# Altium project PiDSP.PrjPcb (part 1 of 2)
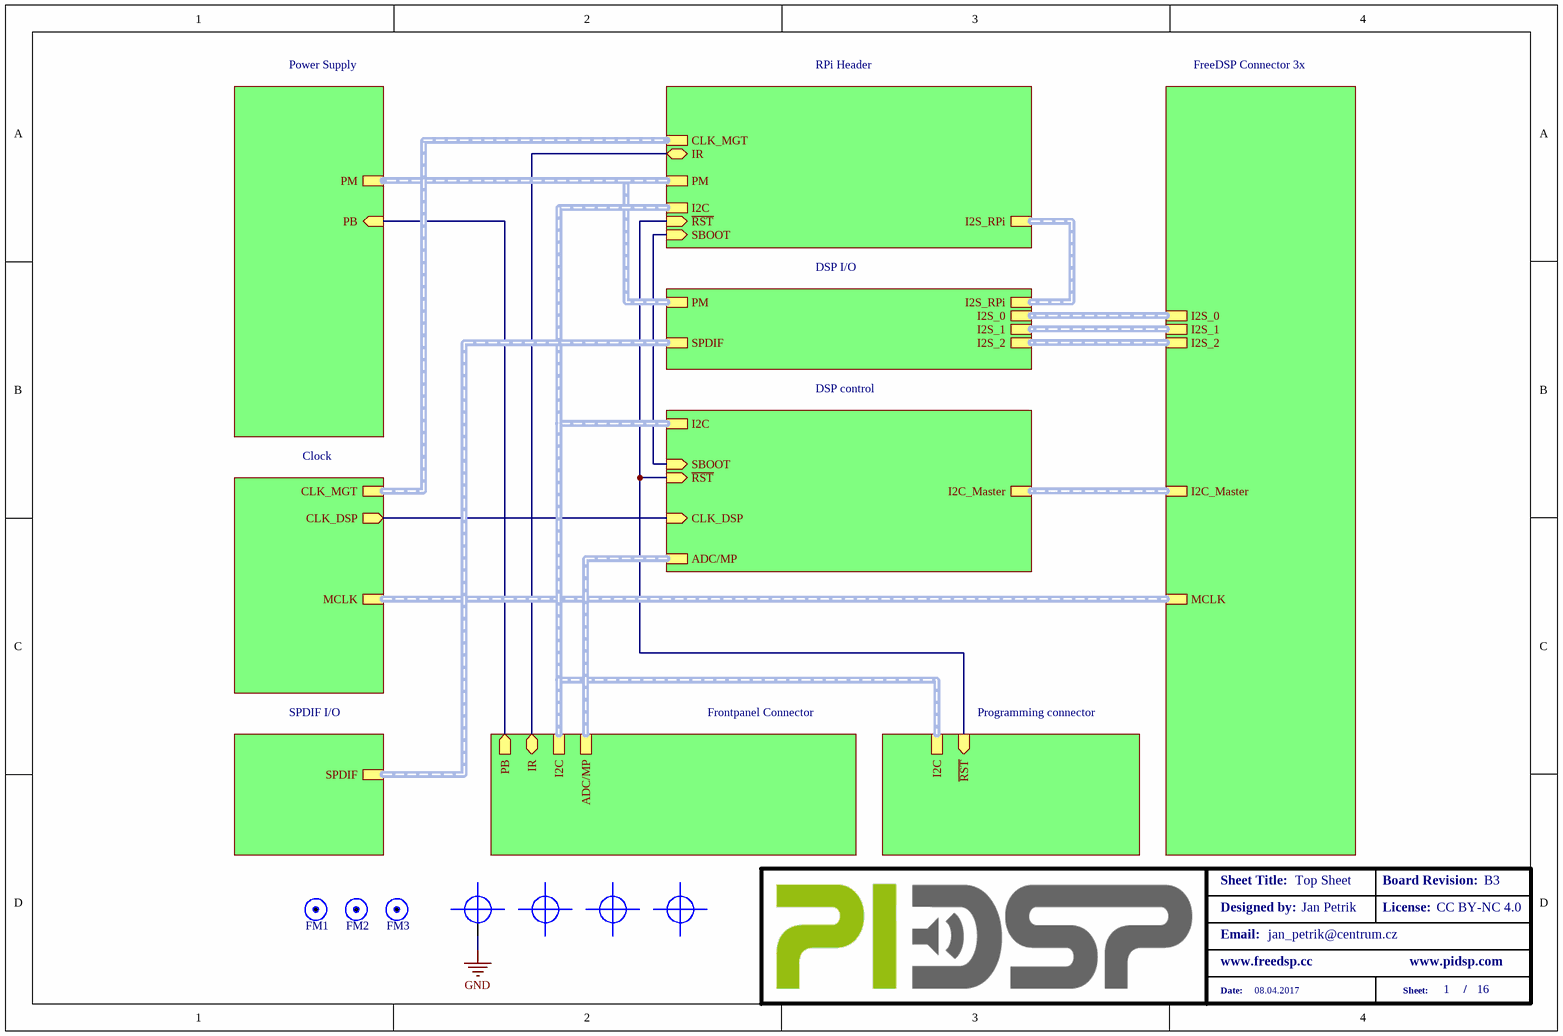
[diagram p0: DSP.SchDoc]
revision: B3
16 sheets, 290 parts. Net scope: hierarchical (ports join the sheet entries above them; power ports are global).
Board files: PiDSP.PcbDoc, footprint.PcbDoc
Sheets:
  DSP.SchDoc
    DSP control = DSPcontrol.SchDoc
    Clock = DSPclk.SchDoc
    DSP I/O = DSP_DIO.SchDoc
    RPi Header = RPi&MCU.SchDoc
    Power Supply = PowerSupply.SchDoc
      PLL Reg. = LP5907MFX-3.3NPB.SchDoc
      3.3V&1.2V = TPS54292.SchDoc
      Input = InputFilter.SchDoc
      Buck = Buck+PM.SchDoc
      Decoupling Capacitors = DSPPower.SchDoc
    FreeDSP Connector 3x = IOConn.SchDoc
    SPDIF I/O = SPDIF.SchDoc
    Frontpanel Connector = FrontPanelConnector.SchDoc
      ESD = ESD.SchDoc
    Programming connector = USBi.SchDoc

## Sheet DSP.SchDoc: Top Sheet
size A4; Date: 08.04.2017; Author: Jan Petrik; CompanyName: FreeDSP; DrawnBy: Jan Petrik; Organization: FreeDSP; DocumentNumber: 1; Revision: B3; SheetNumber: 1; SheetTotal: 16; email: jan_petrik@centrum.cz; license: CC BY-NC 4.0; PageSetup: Record=PageOptions|CenterHorizontal=True|CenterVertical=True|PrintScale=0.97|XCorrection=1.00|YCorrection=1.00|PrintKind=2|BorderSize=5000000|LeftOffset=0|BottomOffset=0|Orientation=2|PaperLength=1000|PaperWidth=1000|Scale=100|PaperSource=7|PrintQuality=-3|MediaType=1|DitherType=10|PrintScaleMode=1|PaperKind=A4|PaperIndex=9; drawing number: blablabla; Version1: N/A; Version2: N/A; Version3: N/A; Change1description: N/A; Change2description: N/A; Change3description: N/A; Change1DrawnBy: N/A; Change2DrawnBy: N/A; Change3DrawnBy: N/A; Change1CheckedBy: N/A; Change2CheckedBy: N/A; Change3CheckedBy: N/A; PreviusVersion_Chng1: N/A; PreviusVersion_Chng2: N/A; PreviusVersion_Chng3: N/A; Variant1description: Standard assembly; Variant2description: N/A; Variant3description: N/A; Variant4description: N/A

### Parts
FM1  Fiducial Mark Circle  [FM_CIRCLE_BTL]  (value not drawn)  (no BOM)
FM2  Fiducial Mark Circle  [FM_CIRCLE_BTL]  (value not drawn)  (no BOM)
FM3  Fiducial Mark Circle  [FM_CIRCLE_BTL]  (value not drawn)  (no BOM)
H1  M3_PLATED_TIGHT FIT  [HOLE_M3_Plated_TightFit]  (value not drawn)  (no BOM)
H2  M3_TIGHT_FIT  [HOLE_M3_TightFit]  (value not drawn)  (no BOM)
H3  M3_TIGHT_FIT  [HOLE_M3_TightFit]  (value not drawn)  (no BOM)
H4  M3_TIGHT_FIT  [HOLE_M3_TightFit]  (value not drawn)  (no BOM)

### Sub-sheets
Clock = DSPclk.SchDoc: MCLK (harness CLK), CLK_DSP (out), CLK_MGT (harness CLK_MGT)
DSP control = DSPcontrol.SchDoc: I2C_Master (harness I2C), SBOOT (in), ~{RST} (in), ADC/MP (harness ADC/MP), I2C (harness I2C), CLK_DSP (in)
DSP I/O = DSP_DIO.SchDoc: I2S_RPi (harness I2S), I2S_1 (harness I2S), I2S_2 (harness I2S), I2S_0 (harness I2S), PM (harness PM), SPDIF (harness SPDIF)
FreeDSP Connector 3x = IOConn.SchDoc: I2C_Master (harness I2C), I2S_0 (harness I2S), I2S_1 (harness I2S), I2S_2 (harness I2S), MCLK (harness CLK)
Frontpanel Connector = FrontPanelConnector.SchDoc: I2C (harness I2C), IR (bidir), ADC/MP (harness ADC/MP), PB (out)
Power Supply = PowerSupply.SchDoc: PB (in), PM (harness PM)
Programming connector = USBi.SchDoc: ~{RST} (in), I2C (harness I2C)
RPi Header = RPi&MCU.SchDoc: I2C (harness I2C), I2S_RPi (harness I2S), ~{RST} (in), SBOOT (in), IR (bidir), PM (harness PM), CLK_MGT (harness CLK_MGT)
SPDIF I/O = SPDIF.SchDoc: SPDIF (harness SPDIF)

### Nets
GND: H1.1
~{RST}: sheet DSP control/~{RST}, sheet RPi Header/~{RST}, sheet Programming connector/~{RST}
CLK_DSP: sheet DSP control/CLK_DSP, sheet Clock/CLK_DSP
IR: sheet RPi Header/IR, sheet Frontpanel Connector/IR
PB: sheet Power Supply/PB, sheet Frontpanel Connector/PB
SBOOT: sheet DSP control/SBOOT, sheet RPi Header/SBOOT

Not connected (* = marked no-connect by the designer): H2 #; H3 #; H4 #

### Buses and harness runs
harness sheet Clock/CLK_MGT = sheet RPi Header/CLK_MGT
harness sheet Clock/MCLK = sheet FreeDSP Connector 3x/MCLK
harness sheet DSP control/ADC/MP = sheet Frontpanel Connector/ADC/MP
harness sheet DSP control/I2C = sheet Frontpanel Connector/I2C = sheet Programming connector/I2C = sheet RPi Header/I2C
harness sheet DSP control/I2C_Master = sheet FreeDSP Connector 3x/I2C_Master
harness sheet DSP I/O/I2S_0 = sheet FreeDSP Connector 3x/I2S_0
harness sheet DSP I/O/I2S_1 = sheet FreeDSP Connector 3x/I2S_1
harness sheet DSP I/O/I2S_2 = sheet FreeDSP Connector 3x/I2S_2
harness sheet DSP I/O/I2S_RPi = sheet RPi Header/I2S_RPi
harness sheet DSP I/O/PM = sheet Power Supply/PM = sheet RPi Header/PM
harness sheet DSP I/O/SPDIF = sheet SPDIF I/O/SPDIF

### Notes on the sheet
- Designed by:
- Sheet Title:
- Board Revision:
- License:
- Email:
- www.freedsp.cc
- www.pidsp.com
- Date:
- Sheet:
- /

### Library data of the parts
FM1-FM3 = FIDUCIAL_MARK_CIRCLE_BTL: SMD: 1
H1 = M3_PLATED_TIGHT FIT: M3 mounting hole
H2-H4 = M3_TIGHT_FIT: M3 mounting hole

## Sheet DSPcontrol.SchDoc: DSP Control
size A4; Date: 08.04.2017; Author: Jan Petrik; CompanyName: FreeDSP; DrawnBy: Jan Petrik; Organization: FreeDSP; DocumentNumber: 10; Revision: B3; SheetNumber: 10; SheetTotal: 16; Version1: N/A; Version2: N/A; Version3: N/A; Change1description: N/A; Change2description: N/A; Change3description: N/A; Change1DrawnBy: N/A; Change2DrawnBy: N/A; Change3DrawnBy: N/A; Change1CheckedBy: N/A; Change2CheckedBy: N/A; Change3CheckedBy: N/A; PreviusVersion_Chng1: N/A; PreviusVersion_Chng2: N/A; PreviusVersion_Chng3: N/A; Variant1description: Standard assembly; Variant2description: N/A; Variant3description: N/A; Variant4description: N/A; email: jan_petrik@centrum.cz; license: CC BY-NC 4.0
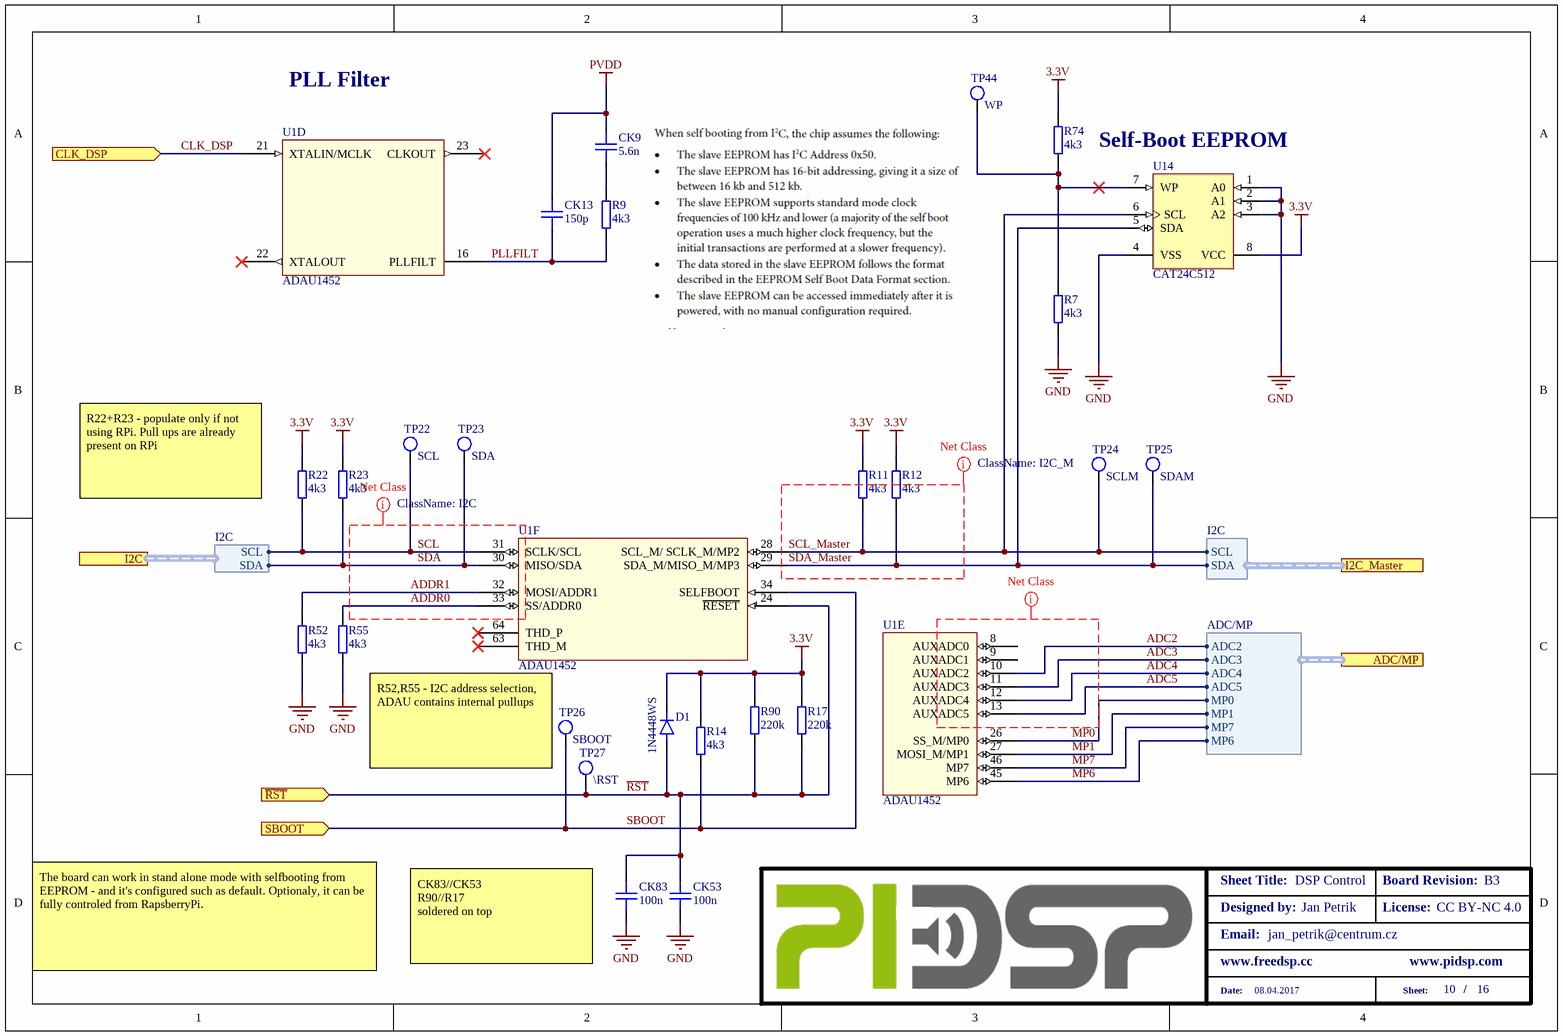
[diagram p1: DSPcontrol.SchDoc]

### Parts
CK9  5.6n  [CAPC1608X09N(SMC0603)]
CK13  150p  [CAPC1608X09N(SMC0603)]
CK53  100n  [CAPC1608X09N(SMC0603)]
CK83  100n  [CAPC1608X09N(SMC0603)]
D1  1N4448WS  [SOD-323]
R7  4k3  [RESC1608X06N(SMR0603)]
R9  4k3  [RESC1608X06N(SMR0603)]
R11  4k3  [RESC1608X06N(SMR0603)]
R12  4k3  [RESC1608X06N(SMR0603)]
R14  4k3  [RESC1608X06N(SMR0603)]
R17  220k  [RESC1608X06N(SMR0603)]
R22  4k3  [RESC1608X06N(SMR0603)]
R23  4k3  [RESC1608X06N(SMR0603)]
R52  4k3  [RESC1608X06N(SMR0603)]
R55  4k3  [RESC1608X06N(SMR0603)]
R74  4k3  [RESC1608X06N(SMR0603)]
R90  220k  [RESC1608X06N(SMR0603)]
TP22  SCL  [TP_0.8/0.4_ROUND]  (no BOM)
TP23  SDA  [TP_0.8/0.4_ROUND]  (no BOM)
TP24  SCLM  [TP_0.8/0.4_ROUND]  (no BOM)
TP25  SDAM  [TP_0.8/0.4_ROUND]  (no BOM)
TP26  SBOOT  [TP_0.8/0.4_ROUND]  (no BOM)
TP27  \RST  [TP_0.8/0.4_ROUND]  (no BOM)
TP44  WP  [TP_0.8/0.4_ROUND]  (no BOM)
U1  ADAU1452  [CP_72_6-handsoldering]  (parts D,E,F of 6)
U14  CAT24C512  [SOIC127P600X175-8N(SOIC_8)]

### Ports
ADC/MP (harness ADC/MP), CLK_DSP (in), I2C (harness I2C), I2C_Master (harness I2C), SBOOT (in), ~{RST} (in)

### Harnesses
I2C: SDA, SCL
ADC/MP: ADC2, ADC3, ADC4, ADC5, MP1, MP0, MP7, MP6
I2C: SCL, SDA

### Nets
3.3V: D1.1(C) R11.2 R12.2 R14.2 R17.2 R22.2 R23.2 R74.2 R90.2 U14.8(VCC)
GND: CK53.2 CK83.2 R7.1 R52.1 R55.1 U14.1(A0) U14.2(A1) U14.3(A2) U14.4(VSS)
PVDD: CK9.1 CK13.1
~{RST}: CK53.1 CK83.1 D1.2(A) R17.1 R90.1 TP27.1 U1.24(~{RESET}) ; port ~{RST}
ADC2: U1.10(AUXADC2) ; port ADC/MP.ADC2
ADC3: U1.11(AUXADC3) ; port ADC/MP.ADC3
ADC4: U1.12(AUXADC4) ; port ADC/MP.ADC4
ADC5: U1.13(AUXADC5) ; port ADC/MP.ADC5
ADDR0: R55.2 U1.33(SS/ADDR0)
ADDR1: R52.2 U1.32(MOSI/ADDR1)
CLK_DSP: U1.21(XTALIN/MCLK) ; port CLK_DSP
MP0: U1.26(SS_M/MP0) ; port ADC/MP.MP0
MP1: U1.27(MOSI_M/MP1) ; port ADC/MP.MP1
MP6: U1.45(MP6) ; port ADC/MP.MP6
MP7: U1.46(MP7) ; port ADC/MP.MP7
PLLFILT: CK13.2 R9.1 U1.16(PLLFILT)
SBOOT: R14.1 TP26.1 U1.34(SELFBOOT) ; port SBOOT
SCL: R22.1 TP22.1 U1.31(SCLK/SCL) ; port I2C.SCL
SCL_Master: R11.1 TP24.1 U1.28(SCL_M/_SCLK_M/MP2) U14.6(SCL) ; port I2C_Master.SCL
SDA: R23.1 TP23.1 U1.30(MISO/SDA) ; port I2C.SDA
SDA_Master: R12.1 TP25.1 U1.29(SDA_M/MISO_M/MP3) U14.5(SDA) ; port I2C_Master.SDA
NetCK9_2: CK9.2 R9.2
NetR7_2: R7.2 R74.1 TP44.1 U14.7(WP)

Not connected (* = marked no-connect by the designer): U1 8(AUXADC0) 9(AUXADC1) 22(XTALOUT)* 23(CLKOUT)* 63(THD_M)* 64(THD_P)*

### Layout directives
net class I2C: ADDR0, ADDR1, SCL, SDA
net class ADC: (no net found under the mark)
net class I2C_M: SCL_Master, SDA_Master

### Notes on the sheet
- PLL Filter
- Self-Boot EEPROM
- (near R22) R22+R23 - populate only if not using RPi. Pull ups are already present on RPi
- (near TP26) R52,R55 - I2C address selection,
  ADAU contains internal pullups
- The board can work in stand alone mode with selfbooting from EEPROM - and it's configured such as default. Optionaly, it can be fully controled from RapsberryPi.
- (near CK83) CK83//CK53
  R90//R17
  soldered on top
- Designed by:
- Sheet Title:
- Board Revision:
- License:
- Email:
- www.freedsp.cc
- www.pidsp.com
- Date:
- Sheet:
- /

### Library data of the parts
CK9 = 5.6n-50V-0603-X7R: MLCC; Mfg. Part Number: 81-GRM1885C1H562JA1D; Signal Integrity: Cap; Tolerance: 10%; Voltage: 50V; Mfgr.: Murata; Value: 5.6n; Package: SMC0603; Simulation: Cap; Author: JP/27.03.2014; Supplier 1: Mouser
CK13 = 150p-50V-0603-NP0: MLCC; Mfg. Part Number: 80-C0603C151J5G; Signal Integrity: Cap; Tolerance: 10%; Voltage: 50V; Value: 150p; Package: SMC0603; Simulation: Cap; Author: JP/27.03.2014; Supplier 1: Mouser
CK53 CK83 = 100n-50V-0603-X7R: MLCC; Signal Integrity: Cap; Voltage: 50V; Tolerance: 10%; Value: 100n; Package: SMC2523; Simulation: Cap; Author: JP/27.03.2014; Supplier 1: Mouser; Supplier Part Number 1: 81-GRM39X104K50D
D1 = 1N4448WS: Small signal diode; Current: 0.150A; Voltage: 75V; SMD: 1; Type: Diode; Package: SOD-323; Supplier 1: Mouser; Supplier Part Number 1: 512-1N4448WS
R7 R9 R11 R12 R14 R22 R23 R52 R55 R74 = 4K3-100mW-0603-ThickFilm: Chip Resistor; Tolerance & Rating: 1%/0.1W; Signal Integrity: Res; Packare: SMR0603; Value: 4k3; Simulation: Res; Author: JP/10.06.2014; SMD: 1; Supplier 1: Mouser; Supplier Part Number 1: 603-RC0603FR-074K3L; Type: Resistor
R17 R90 = 220k-100mW-0603-ThickFilm: Chip Resistor; Tolerance & Rating: 1%/0.1W; Signal Integrity: Res; Packare: SMR0603; Value: 220k; Simulation: Res; Author: JP/10.06.2014; SMD: 1; Supplier 1: Mouser; Supplier Part Number 1: 603-RC0603FR-07220KL; Type: Resistor
TP22-TP27 TP44 = TEST_POINT_VIA: Testpoint - VIA; Value: 0.65/1.55; SMD: -; ClassName: TP
U14 = CAT24C512: 512 Kb I2C CMOS Serial  EEPROM; Supplier 1: Mouser; Supplier Part Number 1: 863-CAT24C512WI-GT3
U1 = ADAU1452: SMD: 1; Supplier 1: Mouser; Supplier Part Number 1: 584-ADAU1452WBCPZ

## Sheet DSPclk.SchDoc: Clock Management
size A4; Date: 08.04.2017; Author: Jan Petrik; CompanyName: FreeDSP; DrawnBy: Jan Petrik; Organization: FreeDSP; DocumentNumber: 8; Revision: B2; SheetNumber: 8; SheetTotal: 16; email: jan_petrik@centrum.cz; license: CC BY-NC 4.0
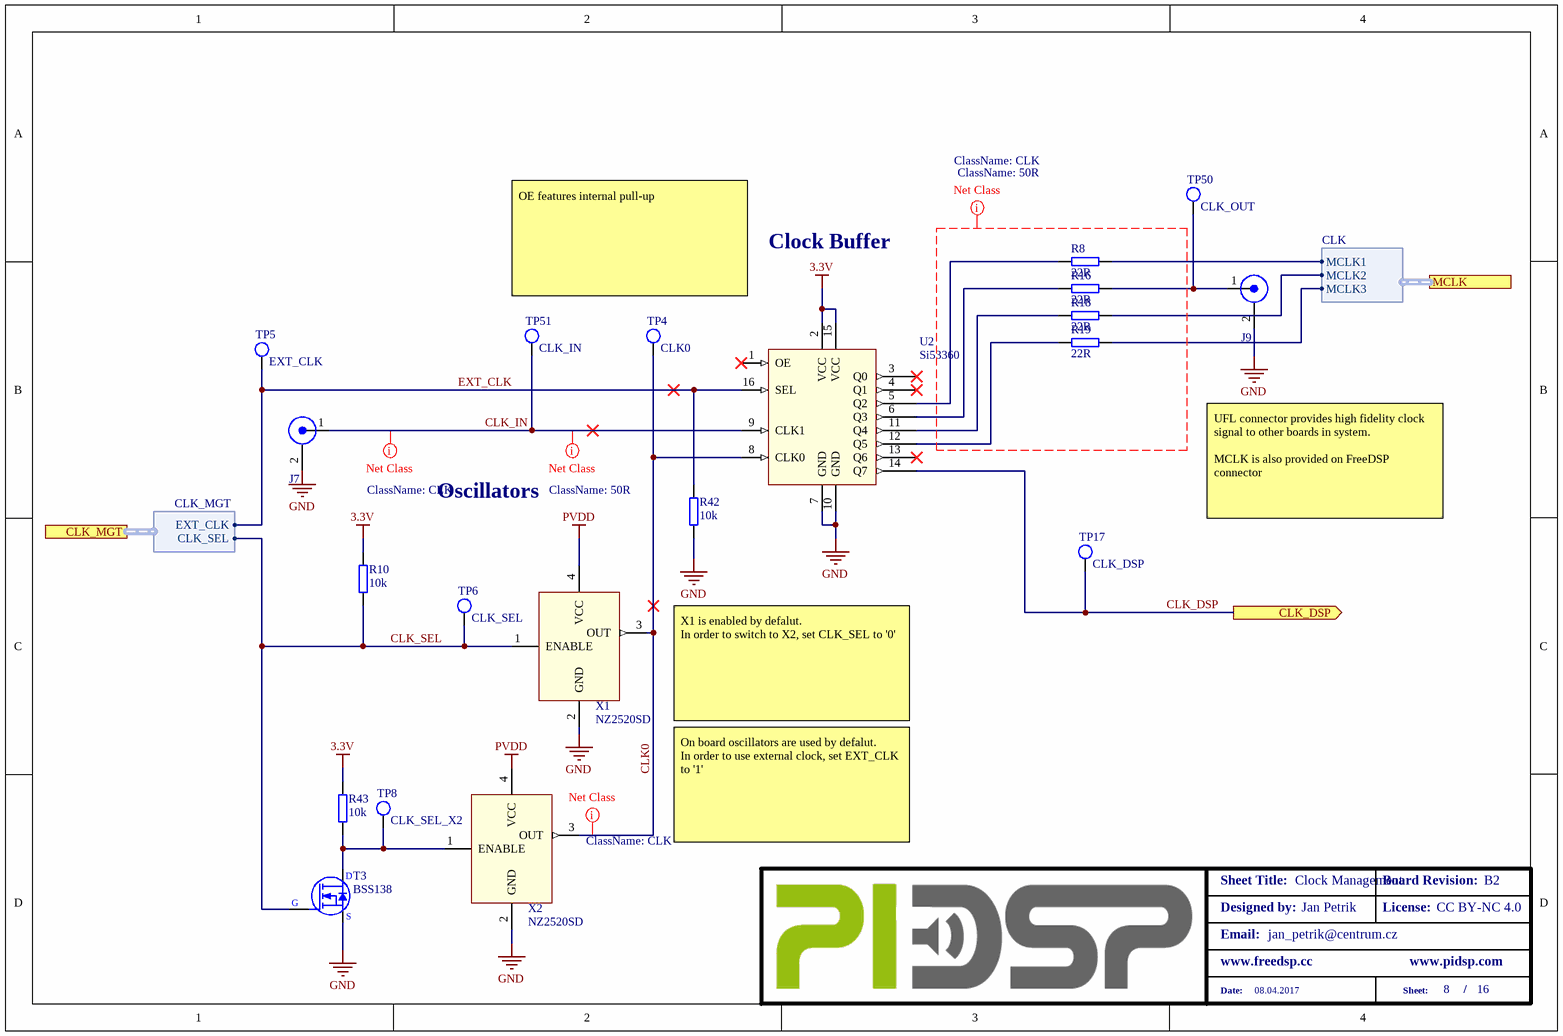
[diagram p2: DSPclk.SchDoc]

### Parts
J7  CLK_IN  [U.FL-R-SMT]  (value not drawn)
J9  CLK_OUT  [U.FL-R-SMT]  (value not drawn)
R8  22R  [RESC1608X06N(SMR0603)]
R10  10k  [RESC1608X06N(SMR0603)]
R16  22R  [RESC1608X06N(SMR0603)]
R18  22R  [RESC1608X06N(SMR0603)]
R19  22R  [RESC1608X06N(SMR0603)]
R42  10k  [RESC1608X06N(SMR0603)]
R43  10k  [RESC1608X06N(SMR0603)]
T3  BSS138  [SOT95P230X110-3N(SOT23)]
TP4  CLK0  [TP_0.8/0.4_ROUND]  (no BOM)
TP5  EXT_CLK  [TP_0.8/0.4_ROUND]  (no BOM)
TP6  CLK_SEL  [TP_0.8/0.4_ROUND]  (no BOM)
TP8  CLK_SEL_X2  [TP_0.8/0.4_ROUND]  (no BOM)
TP17  CLK_DSP  [TP_0.8/0.4_ROUND]  (no BOM)
TP50  CLK_OUT  [TP_0.8/0.4_ROUND]  (no BOM)
TP51  CLK_IN  [TP_0.8/0.4_ROUND]  (no BOM)
U2  Si53360  [TSOP65P640X120-16N (TSSOP16-4.4MM)]
X1  NZ2520SD  [2.5x2mm osclillator]
X2  NZ2520SD  [2.5x2mm osclillator]

### Ports
CLK_DSP (out), CLK_MGT (harness CLK_MGT), MCLK (harness CLK)

### Harnesses
CLK: MCLK1, MCLK2, MCLK3
CLK_MGT: EXT_CLK, CLK_SEL

### Nets
3.3V: R10.2 R43.2 U2.2(VCC) U2.15(VCC)
GND: J7.2(GND) J9.2(GND) R42.1 T3.2(S) U2.7(GND) U2.10(GND) X1.2(GND) X2.2(GND)
PVDD: X1.4(VCC) X2.4(VCC)
CLK0: TP4.1 U2.8(CLK0) X1.3(OUT) X2.3(OUT)
CLK_DSP: TP17.1 U2.14(Q7) ; port CLK_DSP
CLK_IN: J7.1(Signal) TP51.1 U2.9(CLK1)
CLK_SEL: R10.1 T3.1(G) TP6.1 X1.1(ENABLE) ; port CLK_MGT.CLK_SEL
EXT_CLK: R42.2 TP5.1 U2.16(SEL) ; port CLK_MGT.EXT_CLK
MCLK1: R8.2 ; port MCLK.MCLK1
MCLK2: R18.2 ; port MCLK.MCLK2
MCLK3: R19.2 ; port MCLK.MCLK3
NetJ9_1: J9.1(Signal) R16.2 TP50.1
NetR8_1: R8.1 U2.5(Q2)
NetR16_1: R16.1 U2.6(Q3)
NetR18_1: R18.1 U2.11(Q4)
NetR19_1: R19.1 U2.12(Q5)
NetR43_1: R43.1 T3.3(D) TP8.1 X2.1(ENABLE)

Not connected (* = marked no-connect by the designer): U2 1(OE)* 3(Q0)* 4(Q1)* 13(Q6)*

### Layout directives
net class CLK: CLK0, CLK_IN
net class CLK; net class 50R: (no net found under the mark)
net class 50R: CLK_IN

### Notes on the sheet
- Clock Buffer
- OE features internal pull-up
- Oscillators
- UFL connector provides high fidelity clock signal to other boards in system.
  MCLK is also provided on FreeDSP connector
- X1 is enabled by defalut.
  In order to switch to X2, set CLK_SEL to '0'
- On board oscillators are used by defalut.
  In order to use external clock, set EXT_CLK to '1'
- Designed by:
- Sheet Title:
- Board Revision:
- License:
- Email:
- www.freedsp.cc
- www.pidsp.com
- Date:
- Sheet:
- /

### Library data of the parts
J7 J9 = UFL: Subminiature connector; Mfg. PN: 1909763-1; SMD: 0; Supplier 1: Mouser; Supplier Part Number 1: 571-1909763-1
R8 R16 R18 R19 = 22R-100mW-0603-ThickFilm: Chip Resistor; Tolerance & Rating: 1%/0.1W; Signal Integrity: Res; Packare: SMR0603; Value: 22R; Simulation: Res; Author: JP/10.06.2014; SMD: 1; Supplier 1: Mouser; Supplier Part Number 1: 603-RC0603FR-0722RL; Type: Resistor
R10 R42 R43 = 10k-100mW-0603-ThickFilm: Chip Resistor; Tolerance & Rating: 1%/0.1W; Signal Integrity: Res; Packare: SMR0603; Value: 10k; Simulation: Res; Author: JP/10.06.2014; SMD: 1; Supplier 1: Mouser; Supplier Part Number 1: 603-RC0603FR-0710KL; Type: Resistor
T3 = ET+BSS138XX0: N-MOSFET, Logic Level, 50V/0,22A/3.5Ohm; Tolerance & Rating: 50 V/0,2 A/0,36 W; Author: JM 2.7.2014; SMD: 1; Value: BSS138; PN: BSS138; Supplier 1: Mouser; Supplier Part Number 1: 512-BSS138
TP4-TP6 TP8 TP17 TP50 TP51 = TEST_POINT_VIA: Testpoint - VIA; Value: 0.65/1.55; SMD: -; ClassName: TP
U2 = Si53360: 1:8 LOW JITTER CMOS CLOCK BUFFER  WITH 2:1 INPUT MUX; SMD: 1; Supplier 1: Mouser; Value: Si53360; Supplier Part Number 1: 634-SI53360-B-GT
X1 X2 = NZ2520SD: Low Phase Noise Oscillator

## Sheet DSP_DIO.SchDoc: DSP I/O
size A4; Date: 08.04.2017; Author: Jan Petrik; CompanyName: FreeDSP; DrawnBy: Jan Petrik; Organization: FreeDSP; DocumentNumber: 11; Revision: B2; SheetNumber: 11; SheetTotal: 16; email: jan_petrik@centrum.cz; license: CC BY-NC 4.0; PageSetup: Record=PageOptions|CenterHorizontal=True|CenterVertical=True|PrintScale=0.97|XCorrection=1.00|YCorrection=1.00|PrintKind=2|BorderSize=5000000|LeftOffset=0|BottomOffset=0|Orientation=2|PaperLength=1000|PaperWidth=1000|Scale=100|PaperSource=7|PrintQuality=-3|MediaType=1|DitherType=10|PrintScaleMode=1|PaperKind=A4|PaperIndex=9; drawing number: blablabla; Version1: N/A; Version2: N/A; Version3: N/A; Change1description: N/A; Change2description: N/A; Change3description: N/A; Change1DrawnBy: N/A; Change2DrawnBy: N/A; Change3DrawnBy: N/A; Change1CheckedBy: N/A; Change2CheckedBy: N/A; Change3CheckedBy: N/A; PreviusVersion_Chng1: N/A; PreviusVersion_Chng2: N/A; PreviusVersion_Chng3: N/A; Variant1description: Standard assembly; Variant2description: N/A; Variant3description: N/A; Variant4description: N/A
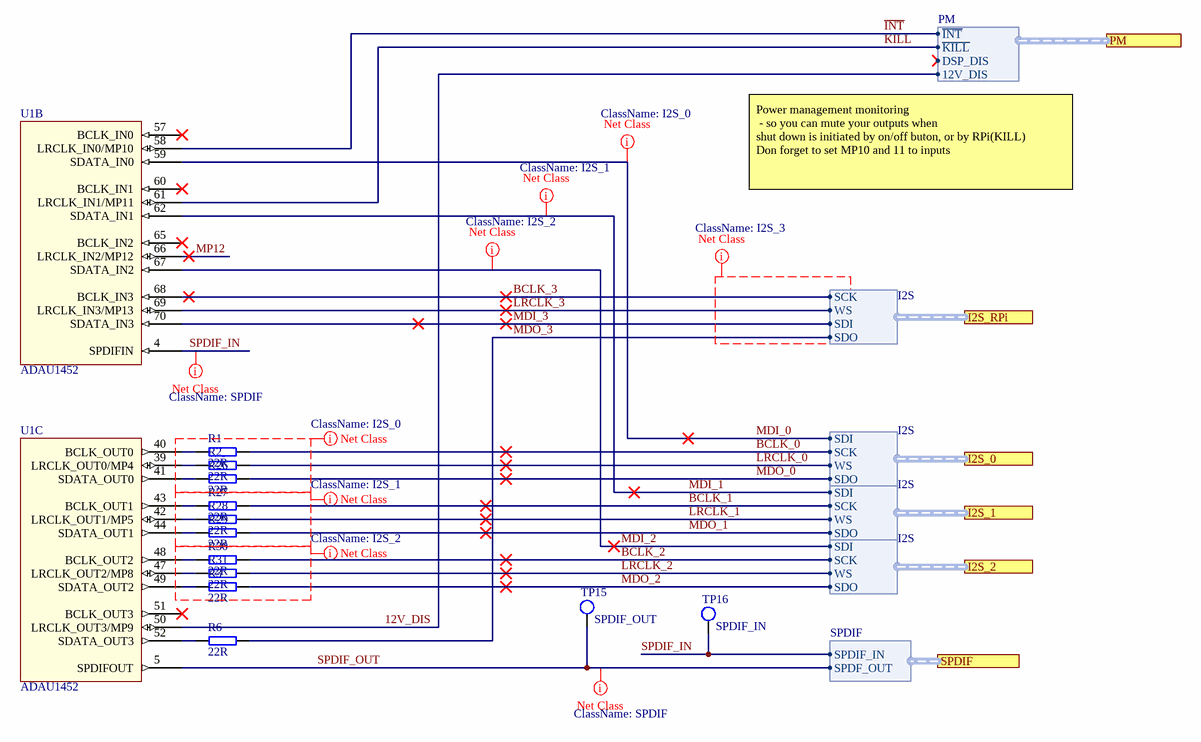
[diagram p3: DSP_DIO.SchDoc]

### Parts
R1  22R  [RESC1608X06N(SMR0603)]
R2  22R  [RESC1608X06N(SMR0603)]
R3  22R  [RESC1608X06N(SMR0603)]
R6  22R  [RESC1608X06N(SMR0603)]
R26  22R  [RESC1608X06N(SMR0603)]
R27  22R  [RESC1608X06N(SMR0603)]
R28  22R  [RESC1608X06N(SMR0603)]
R29  22R  [RESC1608X06N(SMR0603)]
R30  22R  [RESC1608X06N(SMR0603)]
R31  22R  [RESC1608X06N(SMR0603)]
TP15  SPDIF_OUT  [TP_0.8/0.4_ROUND]  (no BOM)
TP16  SPDIF_IN  [TP_0.8/0.4_ROUND]  (no BOM)
U1  ADAU1452  [CP_72_6-handsoldering]  (parts B,C of 6)

### Ports
I2S_0 (harness I2S), I2S_1 (harness I2S), I2S_2 (harness I2S), I2S_RPi (harness I2S), PM (harness PM), SPDIF (harness SPDIF)

### Harnesses
I2S: SDI, WS, SCK, SDO
PM: ~{INT}, ~{KILL}, DSP_DIS, 12V_DIS
SPDIF: SPDIF_IN, SPDF_OUT

### Nets
12V_DIS: U1.50(LRCLK_OUT3/MP9) ; port PM.12V_DIS
BCLK_0: R1.1 ; port I2S_0.SCK  [project net BCKO_0]
BCLK_1: R27.1 ; port I2S_1.SCK  [project net BCKO_1]
BCLK_2: R30.1 ; port I2S_2.SCK  [project net BCKO_2]
BCLK_3: U1.68(BCLK_IN3) ; port I2S_RPi.SCK  [project net BCKI_3]
~{INT}: U1.58(LRCLK_IN0/MP10) ; port PM.~{INT}
~{KILL}: U1.61(LRCLK_IN1/MP11) ; port PM.~{KILL}
LRCLK_0: R2.1 ; port I2S_0.WS  [project net LRCKO_0]
LRCLK_1: R28.1 ; port I2S_1.WS  [project net LRCKO_1]
LRCLK_2: R31.1 ; port I2S_2.WS  [project net LRCKO_2]
LRCLK_3: U1.69(LRCLK_IN3/MP13) ; port I2S_RPi.WS  [project net LRCKI_3]
MDI_0: U1.59(SDATA_IN0) ; port I2S_0.SDI
MDI_1: U1.62(SDATA_IN1) ; port I2S_1.SDI
MDI_2: U1.67(SDATA_IN2) ; port I2S_2.SDI
MDI_3: U1.70(SDATA_IN3) ; port I2S_RPi.SDI
MDO_0: R26.1 ; port I2S_0.SDO
MDO_1: R29.1 ; port I2S_1.SDO
MDO_2: R3.1 ; port I2S_2.SDO
MDO_3: R6.1 ; port I2S_RPi.SDO
MP12: U1.66(LRCLK_IN2/MP12)
SPDIF_IN: TP16.1 U1.4(SPDIFIN) ; port SPDIF.SPDIF_IN
SPDIF_OUT: TP15.1 U1.5(SPDIFOUT) ; port SPDIF.SPDF_OUT
NetR1_2: R1.2 U1.40(BCLK_OUT0)
NetR2_2: R2.2 U1.39(LRCLK_OUT0/MP4)
NetR3_2: R3.2 U1.49(SDATA_OUT2)
NetR6_2: R6.2 U1.52(SDATA_OUT3)
NetR26_2: R26.2 U1.41(SDATA_OUT0)
NetR27_2: R27.2 U1.43(BCLK_OUT1)
NetR28_2: R28.2 U1.42(LRCLK_OUT1/MP5)
NetR29_2: R29.2 U1.44(SDATA_OUT1)
NetR30_2: R30.2 U1.48(BCLK_OUT2)
NetR31_2: R31.2 U1.47(LRCLK_OUT2/MP8)

Not connected (* = marked no-connect by the designer): U1 51(BCLK_OUT3)* 57(BCLK_IN0)* 60(BCLK_IN1)* 65(BCLK_IN2)*

### Layout directives
net class I2S_0: (no net found under the mark), MDI_0
net class I2S_1: (no net found under the mark), MDI_1
net class I2S_2: (no net found under the mark), MDI_2
net class I2S_3: (no net found under the mark)
net class SPDIF: SPDIF_IN, SPDIF_OUT

### Notes on the sheet
- Power management monitoring
  - so you can mute your outputs when
  shut down is initiated by on/off buton, or by RPi(KILL)
  Don forget to set MP10 and 11 to inputs
- Designed by:
- Sheet Title:
- Board Revision:
- License:
- Email:
- www.freedsp.cc
- www.pidsp.com
- Date:
- Sheet:
- /

### Library data of the parts
R1-R3 R6 R26-R31 = 22R-100mW-0603-ThickFilm: as R8 on sheet DSPclk; Value: 22R; Simulation: Res; Author: JP/10.06.2014; SMD: 1; Supplier 1: Mouser; Supplier Part Number 1: 603-RC0603FR-0722RL; Type: Resistor
TP15 TP16 = TEST_POINT_VIA: Testpoint - VIA; Value: 0.65/1.55; SMD: -; ClassName: TP
U1 = ADAU1452: SMD: 1; Supplier 1: Mouser; Supplier Part Number 1: 584-ADAU1452WBCPZ

## Sheet RPi&MCU.SchDoc: RPi
size A4; Date: 08.04.2017; Author: Jan Petrik; CompanyName: FreeDSP; DrawnBy: Jan Petrik; Organization: FreeDSP; DocumentNumber: 9; Revision: B2; SheetNumber: 9; SheetTotal: 16; email: jan_petrik@centrum.cz; license: CC BY-NC 4.0
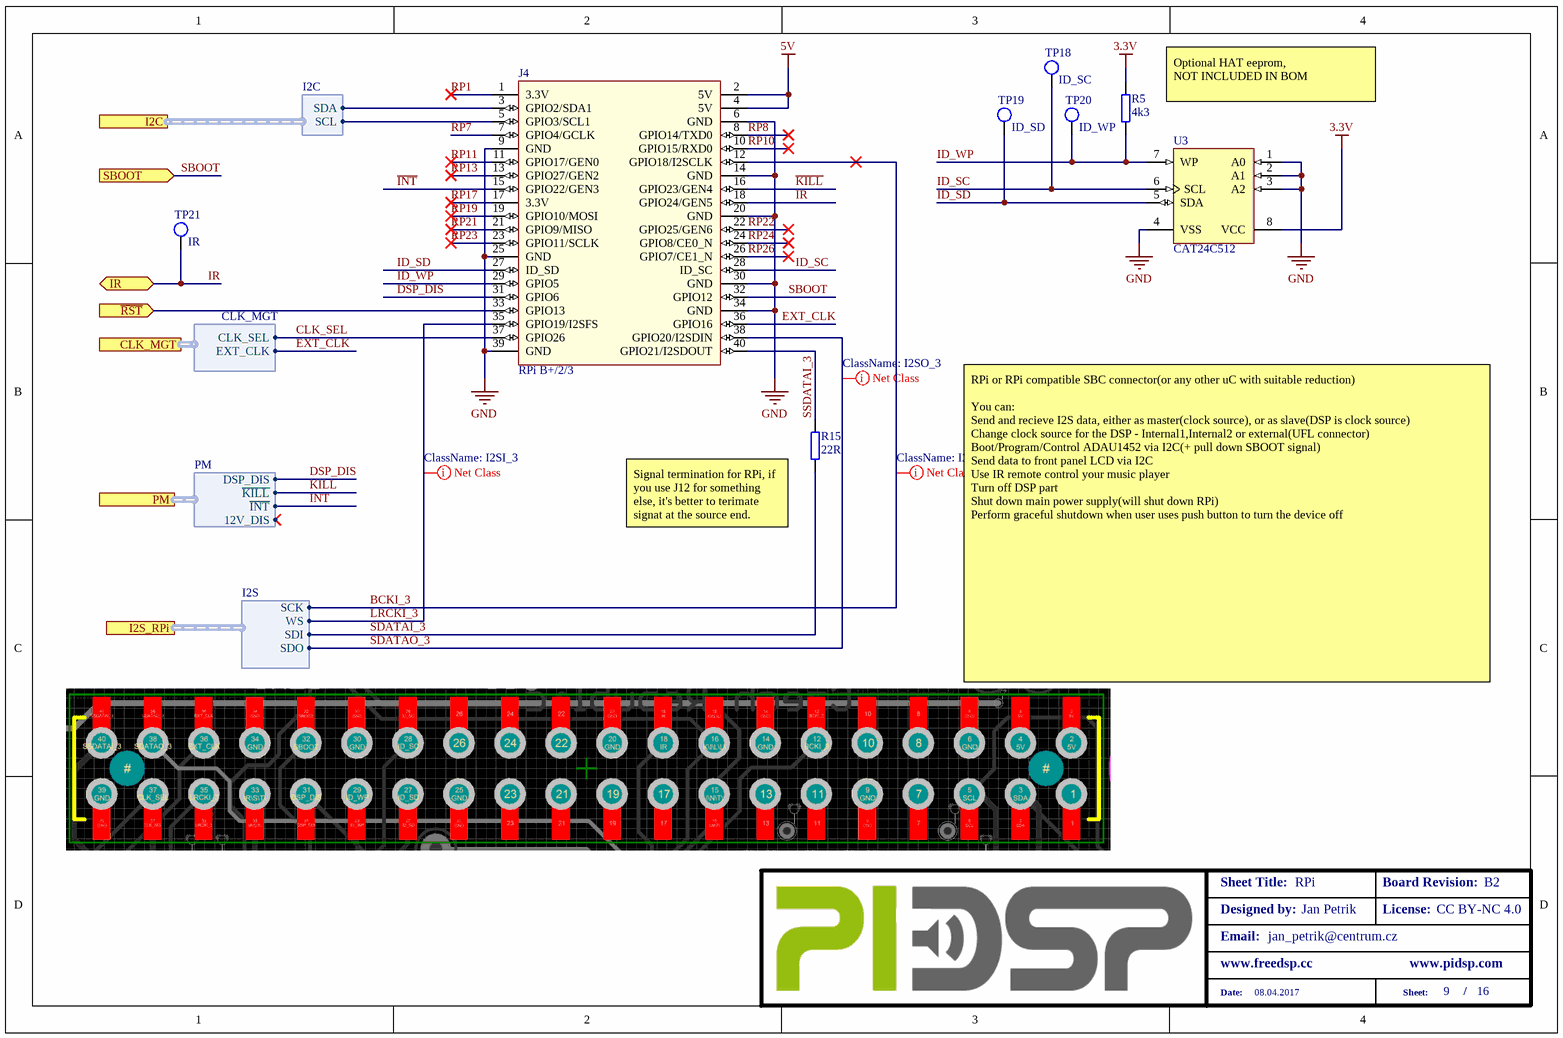
[diagram p4: RPi&MCU.SchDoc]

### Parts
J4  RPi B+/2/3  [RPi 2]
R5  4k3  [RESC1608X06N(SMR0603)]
R15  22R  [RESC1608X06N(SMR0603)]
TP18  ID_SC  [TP_0.8/0.4_ROUND]  (no BOM)
TP19  ID_SD  [TP_0.8/0.4_ROUND]  (no BOM)
TP20  ID_WP  [TP_0.8/0.4_ROUND]  (no BOM)
TP21  IR  [TP_0.8/0.4_ROUND]  (no BOM)
U3  CAT24C512  [SOIC127P600X175-8N(SOIC_8)]

### Ports
CLK_MGT (harness CLK_MGT), I2C (harness I2C), I2S_RPi (harness I2S), IR (bidir), PM (harness PM), SBOOT (in), ~{RST} (in)

### Harnesses
I2C: SDA, SCL
I2S: SDI, WS, SCK, SDO
PM: ~{INT}, ~{KILL}, DSP_DIS, 12V_DIS
CLK_MGT: EXT_CLK, CLK_SEL

### Nets
3.3V: R5.2 U3.8(VCC)
5V: J4.2(5V) J4.4(5V)
GND: J4.6(GND) J4.9(GND) J4.14(GND) J4.20(GND) J4.25(GND) J4.30(GND) J4.34(GND) J4.39(GND) U3.1(A0) U3.2(A1) U3.3(A2) U3.4(VSS)
~{RST}: J4.33(GPIO13) ; port ~{RST}
BCKI_3: J4.12(GPIO18/I2SCLK) ; port I2S_RPi.SCK
CLK_SEL: J4.37(GPIO26) ; port CLK_MGT.CLK_SEL
DSP_DIS: J4.31(GPIO6) ; port PM.DSP_DIS
EXT_CLK: J4.36(GPIO16) ; port CLK_MGT.EXT_CLK
~{INT}: J4.15(GPIO22/GEN3) ; port PM.~{INT}
ID_SC: J4.28(ID_SC) TP18.1 U3.6(SCL)
ID_SD: J4.27(ID_SD) TP19.1 U3.5(SDA)
ID_WP: J4.29(GPIO5) R5.1 TP20.1 U3.7(WP)
IR: J4.18(GPIO24/GEN5) TP21.1 ; port IR
~{KILL}: J4.16(GPIO23/GEN4) ; port PM.~{KILL}
LRCKI_3: J4.35(GPIO19/I2SFS) ; port I2S_RPi.WS
RP1: J4.1(3.3V)
RP7: J4.7(GPIO4/GCLK)
RP8: J4.8(GPIO14/TXD0)
RP10: J4.10(GPIO15/RXD0)
RP11: J4.11(GPIO17/GEN0)
RP13: J4.13(GPIO27/GEN2)
RP17: J4.17(3.3V)
RP19: J4.19(GPIO10/MOSI)
RP21: J4.21(GPIO9/MISO)
RP22: J4.22(GPIO25/GEN6)
RP23: J4.23(GPIO11/SCLK)
RP24: J4.24(GPIO8/CE0_N)
RP26: J4.26(GPIO7/CE1_N)
SBOOT: J4.32(GPIO12) ; port SBOOT
SCL: J4.5(GPIO3/SCL1) ; port I2C.SCL
SDA: J4.3(GPIO2/SDA1) ; port I2C.SDA
SDATAI_3: R15.1 ; port I2S_RPi.SDI  [project net MDI_3]
SDATAO_3: J4.38(GPIO20/I2SDIN) ; port I2S_RPi.SDO  [project net MDO_3]
SSDATAI_3: J4.40(GPIO21/I2SDOUT) R15.2

### Layout directives
net class I2SO_3: MDO_3
net class I2SI_3: BCKI_3, LRCKI_3

### Notes on the sheet
- Optional HAT eeprom,
  NOT INCLUDED IN BOM
- (near R15) Signal termination for RPi, if you use J12 for something else, it's better to terimate signat at the source end.
- RPi or RPi compatible SBC connector(or any other uC with suitable reduction)
  You can:
  Send and recieve I2S data, either as master(clock source), or as slave(DSP is clock source)
  Change clock source for the DSP - Internal1,Internal2 or external(UFL connector)
  Boot/Program/Control ADAU1452 via I2C(+ pull down SBOOT signal)
  Send data to front panel LCD via I2C
  Use IR remote control your music player
  Turn off DSP part
  Shut down main power supply(will shut down RPi)
  Perform graceful shutdown when user uses push button to turn the device off
- Designed by:
- Sheet Title:
- Board Revision:
- License:
- Email:
- www.freedsp.cc
- www.pidsp.com
- Date:
- Sheet:
- /

### Library data of the parts
J4 = Rapsberry Pi 2 B: Rapsberry Pi Header; SMD: 0; Supplier 1: Mouser; Supplier Part Number 1: 517-929975-01-20
R5 = 4K3-100mW-0603-ThickFilm: as R7 on sheet DSPcontrol; Value: 4k3; Simulation: Res; Author: JP/10.06.2014; SMD: 1; Supplier 1: Mouser; Supplier Part Number 1: 603-RC0603FR-074K3L; Type: Resistor
R15 = 22R-100mW-0603-ThickFilm: as R8 on sheet DSPclk; Value: 22R; Simulation: Res; Author: JP/10.06.2014; SMD: 1; Supplier 1: Mouser; Supplier Part Number 1: 603-RC0603FR-0722RL; Type: Resistor
TP18-TP21 = TEST_POINT_VIA: Testpoint - VIA; Value: 0.65/1.55; SMD: -; ClassName: TP
U3 = CAT24C512: 512 Kb I2C CMOS Serial  EEPROM; Supplier 1: Mouser; Supplier Part Number 1: 863-CAT24C512WI-GT3

## Sheet PowerSupply.SchDoc: Power Supply
size A4; Date: 08.04.2017; Author: Jan Petrik; CompanyName: FreeDSP; DrawnBy: Jan Petrik; Organization: FreeDSP; DocumentNumber: 2; Revision: B3; SheetNumber: 2; SheetTotal: 16; email: jan_petrik@centrum.cz; license: CC BY-NC 4.0; PageSetup: Record=PageOptions|CenterHorizontal=True|CenterVertical=True|PrintScale=0.97|XCorrection=1.00|YCorrection=1.00|PrintKind=2|BorderSize=5000000|LeftOffset=0|BottomOffset=0|Orientation=2|PaperLength=1000|PaperWidth=1000|Scale=100|PaperSource=7|PrintQuality=-3|MediaType=1|DitherType=10|PrintScaleMode=1|PaperKind=A4|PaperIndex=9; drawing number: blablabla; Version1: N/A; Version2: N/A; Version3: N/A; Change1description: N/A; Change2description: N/A; Change3description: N/A; Change1DrawnBy: N/A; Change2DrawnBy: N/A; Change3DrawnBy: N/A; Change1CheckedBy: N/A; Change2CheckedBy: N/A; Change3CheckedBy: N/A; PreviusVersion_Chng1: N/A; PreviusVersion_Chng2: N/A; PreviusVersion_Chng3: N/A; Variant1description: Standard assembly; Variant2description: N/A; Variant3description: N/A; Variant4description: N/A
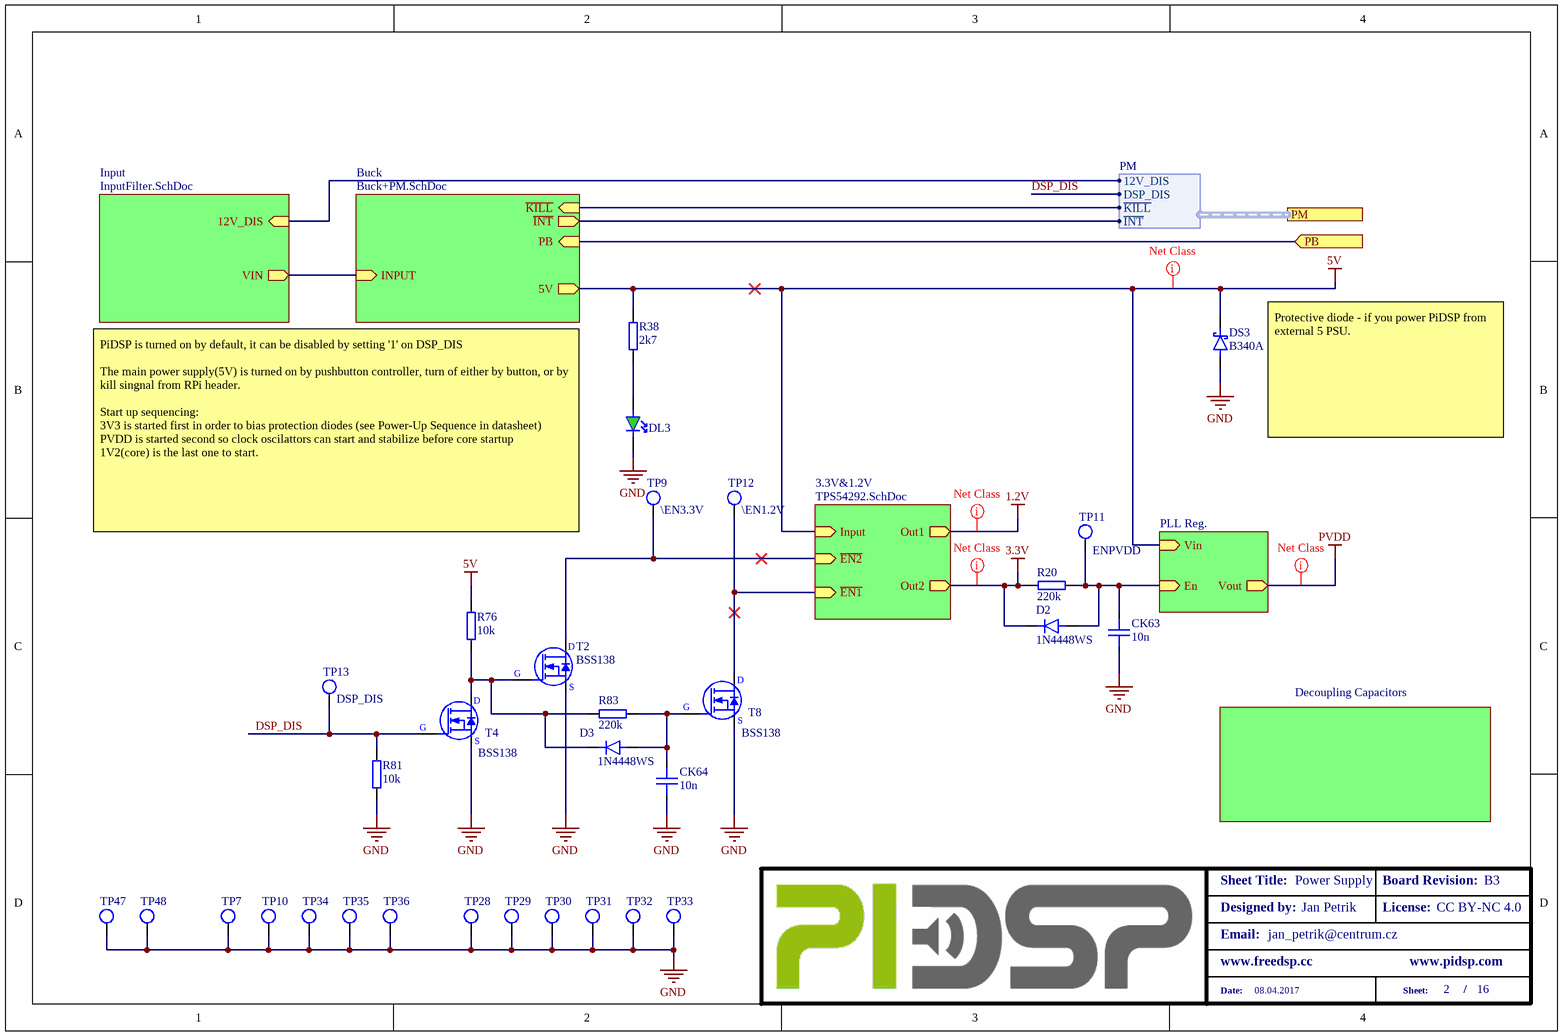
[diagram p5: PowerSupply.SchDoc]

### Parts
CK63  10n  [CAPC1608X09N(SMC0603)]
CK64  10n  [CAPC1608X09N(SMC0603)]
D2  1N4448WS  [SOD-323]
D3  1N4448WS  [SOD-323]
DL3  GREEN  [0603diode]  (value not drawn)
DS3  B340A  [DIOM5127X23N(SMA)]
R20  220k  [RESC1608X06N(SMR0603)]
R38  2k7  [RESC1608X06N(SMR0603)]
R76  10k  [RESC1608X06N(SMR0603)]
R81  10k  [RESC1608X06N(SMR0603)]
R83  220k  [RESC1608X06N(SMR0603)]
T2  BSS138  [SOT95P230X110-3N(SOT23)]
T4  BSS138  [SOT95P230X110-3N(SOT23)]
T8  BSS138  [SOT95P230X110-3N(SOT23)]
TP7  GND  [TP_0.8/0.4_ROUND]  (value not drawn)  (no BOM)
TP9  \EN3.3V  [TP_0.8/0.4_ROUND]  (no BOM)
TP10  GND  [TP_0.8/0.4_ROUND]  (value not drawn)  (no BOM)
TP11  ENPVDD  [TP_0.8/0.4_ROUND]  (no BOM)
TP12  \EN1.2V  [TP_0.8/0.4_ROUND]  (no BOM)
TP13  DSP_DIS  [TP_0.8/0.4_ROUND]  (no BOM)
TP28  GND  [TP_0.8/0.4_ROUND]  (value not drawn)  (no BOM)
TP29  GND  [TP_0.8/0.4_ROUND]  (value not drawn)  (no BOM)
TP30  GND  [TP_0.8/0.4_ROUND]  (value not drawn)  (no BOM)
TP31  GND  [TP_0.8/0.4_ROUND]  (value not drawn)  (no BOM)
TP32  GND  [TP_0.8/0.4_ROUND]  (value not drawn)  (no BOM)
TP33  GND  [TP_0.8/0.4_ROUND]  (value not drawn)  (no BOM)
TP34  GND  [TP_0.8/0.4_ROUND]  (value not drawn)  (no BOM)
TP35  GND  [TP_0.8/0.4_ROUND]  (value not drawn)  (no BOM)
TP36  GND  [TP_0.8/0.4_ROUND]  (value not drawn)  (no BOM)
TP47  GND  [TP_0.8/0.4_ROUND]  (value not drawn)  (no BOM)
TP48  GND  [TP_0.8/0.4_ROUND]  (value not drawn)  (no BOM)

### Sub-sheets
3.3V&1.2V = TPS54292.SchDoc: Out2 (out), Out1 (out), Input (in), ~{EN1} (in), ~{EN2} (in)
Buck = Buck+PM.SchDoc: PB (in), INPUT (in), 5V (out), ~{KILL} (in), ~{INT} (out)
Decoupling Capacitors = DSPPower.SchDoc: no entries
Input = InputFilter.SchDoc: VIN (out), 12V_DIS (in)
PLL Reg. = LP5907MFX-3.3NPB.SchDoc: Vin (in), Vout (out), En (in)

### Ports
PB (in), PM (harness PM)

### Harnesses
PM: ~{INT}, ~{KILL}, DSP_DIS, 12V_DIS

### Nets
3.3V: D2.1(C) R20.2 ; sheet 3.3V&1.2V/Out2
5V: DS3.1(C) R38.1 R76.2 ; sheet PLL Reg./Vin, sheet 3.3V&1.2V/Input, sheet Buck/5V
GND: CK63.2 CK64.1 DL3.1(C) DS3.2(A) R81.1 T2.2(S) T4.2(S) T8.2(S) TP7.1 TP10.1 TP28.1 TP29.1 TP30.1 TP31.1 TP32.1 TP33.1 TP34.1 TP35.1 TP36.1 TP47.1 TP48.1
12V_DIS: sheet Input/12V_DIS, port PM.12V_DIS
DSP_DIS: R81.2 T4.1(G) TP13.1 ; port PM.DSP_DIS
~{INT}: sheet Buck/~{INT}, port PM.~{INT}
~{KILL}: sheet Buck/~{KILL}, port PM.~{KILL}
PB: port PB, sheet Buck/PB
V_IN: sheet Input/VIN, sheet Buck/INPUT
NetCK63_1: CK63.1 D2.2(A) R20.1 TP11.1 ; sheet PLL Reg./En
NetCK64_2: CK64.2 D3.2(A) R83.2 T8.1(G)
NetD3_1: D3.1(C) R76.1 R83.1 T2.1(G) T4.3(D)
NetDL3_2: DL3.2(A) R38.2
NetT2_3: T2.3(D) TP9.1 ; sheet 3.3V&1.2V/~{EN2}
NetT8_3: T8.3(D) TP12.1 ; sheet 3.3V&1.2V/~{EN1}

### Layout directives
net class POWER: 1.2V, 3.3V, 5V, PVDD

### Notes on the sheet
- (near DS3) Protective diode - if you power PiDSP from external 5 PSU.
- PiDSP is turned on by default, it can be disabled by setting '1' on DSP_DIS
  The main power supply(5V) is turned on by pushbutton controller, turn of either by button, or by kill singnal from RPi header.
  Start up sequencing:
  3V3 is started first in order to bias protection diodes (see Power-Up Sequence in datasheet)
  PVDD is started second so clock oscilattors can start and stabilize before core startup
  1V2(core) is the last one to start.
- Designed by:
- Sheet Title:
- Board Revision:
- License:
- Email:
- www.freedsp.cc
- www.pidsp.com
- Date:
- Sheet:
- /

### Library data of the parts
CK63 CK64 = 10n-50V-0603-X7R: MLCC; Signal Integrity: Cap; Voltage: 50V; Tolerance: 10%; Value: 10n; Package: SMC0603; Simulation: Cap; Author: JP/27.03.2014; Supplier 1: Mouser; Supplier Part Number 1: 81-GRM39X103K50D
D2 D3 = 1N4448WS: as D1 on sheet DSPcontrol; SMD: 1; Type: Diode; Package: SOD-323; Supplier 1: Mouser; Supplier Part Number 1: 512-1N4448WS
DL3 = LED_GREEN_0603: Green LED, 0603; Author: JP/31.3.2014; SMD: 1; Supplier 1: Mouser; Supplier Part Number 1: 710-150060GS75000
DS3 = B340A: High Current Density SMT Schottky Rectifier, 3A/40V, SMA; SMD: 1; Supplier 1: Mouser; Supplier Part Number 1: 621-B340-F; Value: B340A
R20 R83 = 220k-100mW-0603-ThickFilm: as R17 on sheet DSPcontrol; Value: 220k; Simulation: Res; Author: JP/10.06.2014; SMD: 1; Supplier 1: Mouser; Supplier Part Number 1: 603-RC0603FR-07220KL; Type: Resistor
R38 = 2K7-100mW-0603-ThickFilm: Chip Resistor; Tolerance & Rating: 1%/0.1W; Signal Integrity: Res; Packare: SMR0603; Value: 2k7; Simulation: Res; Author: JP/26.03.2017; SMD: 1; Supplier 1: Mouser; Supplier Part Number 1: 603-RC0603FR-072K7L; Type: Resistor
R76 R81 = 10k-100mW-0603-ThickFilm: as R10 on sheet DSPclk; Value: 10k; Simulation: Res; Author: JP/10.06.2014; SMD: 1; Supplier 1: Mouser; Supplier Part Number 1: 603-RC0603FR-0710KL; Type: Resistor
T2 T4 T8 = ET+BSS138XX0: as T3 on sheet DSPclk; Author: JM 2.7.2014; SMD: 1; Value: BSS138; PN: BSS138; Supplier 1: Mouser; Supplier Part Number 1: 512-BSS138
TP7 TP9-TP13 TP28-TP36 TP47 TP48 = TEST_POINT_VIA: Testpoint - VIA; Value: 0.65/1.55; SMD: -; ClassName: TP

## Sheet LP5907MFX-3.3NPB.SchDoc: PVDD
size A4; Date: 08.04.2017; Author: Jan Petrik; CompanyName: FreeDSP; DrawnBy: Jan Petrik; Organization: FreeDSP; DocumentNumber: 6; Revision: B2; SheetNumber: 6; SheetTotal: 16; email: jan_petrik@centrum.cz; license: CC BY-NC 4.0
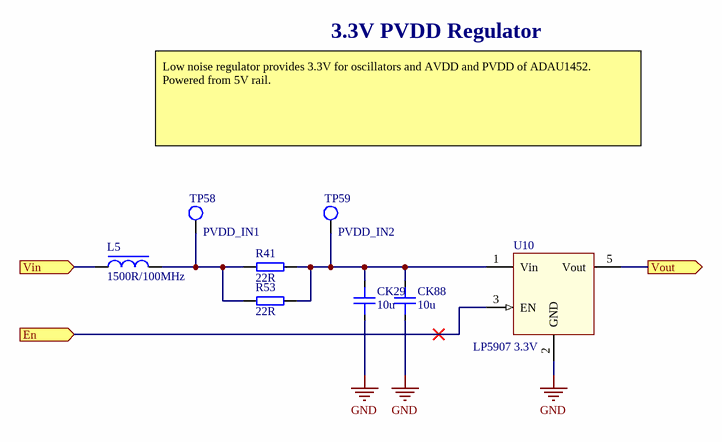
[diagram p6: LP5907MFX-3.3NPB.SchDoc]

### Parts
CK29  10u  [CAPC3216X12N(SMC1206)]
CK88  10u  [CAPC3216X12N(SMC1206)]
L5  1500R/100MHz  [INDC2012X08N(SML0805)]
R41  22R  [RESC1608X06N(SMR0603)]
R53  22R  [RESC1608X06N(SMR0603)]
TP58  PVDD_IN1  [TP_0.8/0.4_ROUND]  (no BOM)
TP59  PVDD_IN2  [TP_0.8/0.4_ROUND]  (no BOM)
U10  LP5907 3.3V  [SOT95P280X90-5N(SOT23-5)]

### Ports
En (in), Vin (in), Vout (out)

### Nets
5V: L5.1 ; port Vin
GND: CK29.2 CK88.2 U10.2(GND)
PVDD: U10.5(Vout) ; port Vout
NetCK29_1: CK29.1 CK88.1 R41.1 R53.1 TP59.1 U10.1(Vin)
NetCK63_1: U10.3(EN) ; port En
NetL5_2: L5.2 R41.2 R53.2 TP58.1

### Notes on the sheet
- 3.3V PVDD Regulator
- Low noise regulator provides 3.3V for oscillators and AVDD and PVDD of ADAU1452.
  Powered from 5V rail.
- Designed by:
- Sheet Title:
- Board Revision:
- License:
- Email:
- www.freedsp.cc
- www.pidsp.com
- Date:
- Sheet:
- /

### Library data of the parts
CK29 CK88 = 10u-50V-1206-X5R: MLCC; Signal Integrity: Cap; Tolerance: 10%; Voltage: 50; Mfgr. PN: GRM31CR61H106MA2L; Mfgr.: Murata; Value: 10u; Package: SMC1206; Simulation: Cap; Author: JP/10.06.2014; Supplier 1: Mouser; Supplier Part Number 1: 81-GRM31CR61H106MA2L
L5 = MMZ2012Y152B: Multilayer SMD Ferrite 1500R/100MHz; Tolerance & Rating: 25%, 100mA/0.55Ohm RDC; Value: 1500R/100MHz; Author: JP/05.06.2014; SMD: 1; Supplier 1: Mouser; Supplier Part Number 1: 810-MMZ2012Y152B
R41 R53 = 22R-100mW-0603-ThickFilm: as R8 on sheet DSPclk; Value: 22R; Simulation: Res; Author: JP/10.06.2014; SMD: 1; Supplier 1: Mouser; Supplier Part Number 1: 603-RC0603FR-0722RL; Type: Resistor
TP58 TP59 = TEST_POINT_VIA: Testpoint - VIA; Value: 0.65/1.55; SMD: -; ClassName: TP
U10 = LP5907MFX-3.3NPB: Ultra  Low-Noise,  250-mA  Linear  Regulator; SMD: 1; Supplier 1: Mouser; Supplier 2: Digi-Key; Supplier Part Number 1: 595-LP5907MFX-3.3NPB; Supplier Part Number 2: 296-38557-1-ND

## Sheet TPS54292.SchDoc: 3.3V+1.2V
size A4; Date: 08.04.2017; Author: Jan Petrik; CompanyName: FreeDSP; DrawnBy: Jan Petrik; Organization: FreeDSP; DocumentNumber: 5; Revision: B2; SheetNumber: 5; SheetTotal: 16; email: jan_petrik@centrum.cz; license: CC BY-NC 4.0
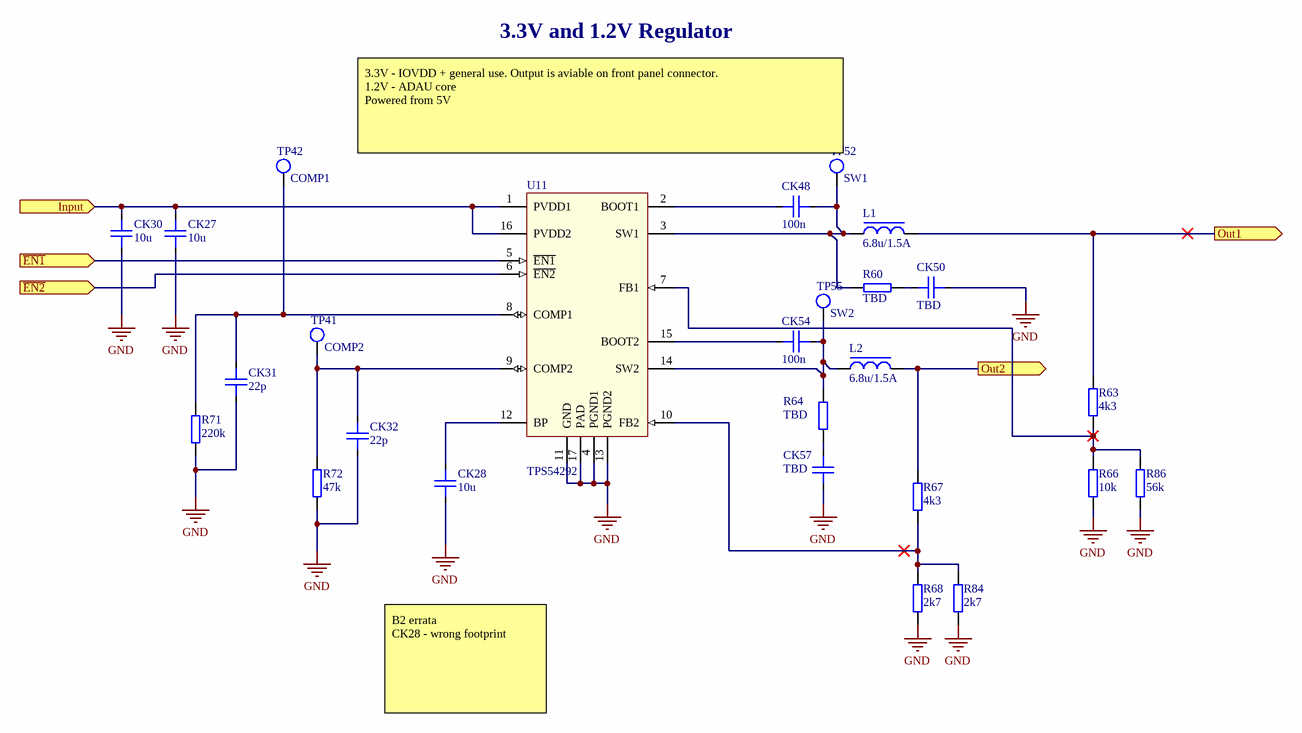
[diagram p7: TPS54292.SchDoc]

### Parts
CK27  10u  [CAPC3216X12N(SMC1206)]
CK28  10u  [CAPC3216X12N(SMC1206)]
CK30  10u  [CAPC3216X12N(SMC1206)]
CK31  22p  [CAPC1608X09N(SMC0603)]
CK32  22p  [CAPC1608X09N(SMC0603)]
CK48  100n  [CAPC1608X09N(SMC0603)]
CK50  TBD  [CAPC1608X09N(SMC0603)]
CK54  100n  [CAPC1608X09N(SMC0603)]
CK57  TBD  [CAPC1608X09N(SMC0603)]
L1  6.8u/1.5A  [INDM_3.8x3.8x1.8]
L2  6.8u/1.5A  [INDM_3.8x3.8x1.8]
R60  TBD  [RESC1608X06N(SMR0603)]
R63  4k3  [RESC1608X06N(SMR0603)]
R64  TBD  [RESC1608X06N(SMR0603)]
R66  10k  [RESC1608X06N(SMR0603)]
R67  4k3  [RESC1608X06N(SMR0603)]
R68  2k7  [RESC1608X06N(SMR0603)]
R71  220k  [RESC1608X06N(SMR0603)]
R72  47k  [RESC1608X06N(SMR0603)]
R84  2k7  [RESC1608X06N(SMR0603)]
R86  56k  [RESC1608X06N(SMR0603)]
TP41  COMP2  [TP_0.8/0.4_ROUND]  (no BOM)
TP42  COMP1  [TP_0.8/0.4_ROUND]  (no BOM)
TP52  SW1  [TP_0.8/0.4_ROUND]  (no BOM)
TP55  SW2  [TP_0.8/0.4_ROUND]  (no BOM)
U11  TPS54292  [TSOP65P640X120_HS-17M(TSSOP16-TP)]

### Ports
Input (in), Out1 (out), Out2 (out), ~{EN1} (in), ~{EN2} (in)

### Nets
1.2V: L1.2 R63.2 ; port Out1
3.3V: L2.2 R67.2 ; port Out2
5V: CK27.1 CK30.1 U11.1(PVDD1) U11.16(PVDD2) ; port Input
GND: CK27.2 CK28.2 CK30.2 CK31.1 CK32.1 CK50.2 CK57.2 R66.1 R68.1 R71.1 R72.1 R84.1 R86.1 U11.4(PGND1) U11.11(GND) U11.13(PGND2) U11.17(PAD)
NetCK28_1: CK28.1 U11.12(BP)
NetCK31_2: CK31.2 R71.2 TP42.1 U11.8(COMP1)
NetCK32_2: CK32.2 R72.2 TP41.1 U11.9(COMP2)
NetCK48_1: CK48.1 U11.2(BOOT1)
NetCK48_2: CK48.2 L1.1 R60.2 TP52.1 U11.3(SW1)
NetCK50_1: CK50.1 R60.1
NetCK54_1: CK54.1 U11.15(BOOT2)
NetCK54_2: CK54.2 L2.1 R64.2 TP55.1 U11.14(SW2)
NetCK57_1: CK57.1 R64.1
NetR63_1: R63.1 R66.2 R86.2 U11.7(FB1)
NetR67_1: R67.1 R68.2 R84.2 U11.10(FB2)
NetT2_3: U11.6(~{EN2}) ; port ~{EN2}
NetT8_3: U11.5(~{EN1}) ; port ~{EN1}

### Notes on the sheet
- 3.3V and 1.2V Regulator
- (near TP52) 3.3V - IOVDD + general use. Output is aviable on front panel connector.
  1.2V - ADAU core
  Powered from 5V
- B2 errata
  CK28 - wrong footprint
- Designed by:
- Sheet Title:
- Board Revision:
- License:
- Email:
- www.freedsp.cc
- www.pidsp.com
- Date:
- Sheet:
- /

### Library data of the parts
CK27 CK28 CK30 = 10u-50V-1206-X5R: MLCC; Signal Integrity: Cap; Voltage: 50; Tolerance: 10%; Mfgr. PN: GRM31CR61H106MA2L; Mfgr.: Murata; Value: 10u; Package: SMC1206; Simulation: Cap; Author: JP/10.06.2014; Supplier 1: Mouser; Supplier Part Number 1: 81-GRM31CR61H106MA2L
  CK27 CK30: ClassName: DirectConnect
CK31 CK32 = 22p-50V-0603-NP0: MLCC; Signal Integrity: Cap; Tolerance: 10%; Voltage: 50V; Value: 22p; Package: SMC0603; Simulation: Cap; Author: JP/27.03.2014; Supplier 1: Mouser; Supplier Part Number 1: 81-GCM1885C1H220J16D
CK48 CK54 = 100n-50V-0603-X7R: as CK53 on sheet DSPcontrol; Value: 100n; Package: SMC2523; Simulation: Cap; Author: JP/27.03.2014; Supplier 1: Mouser; Supplier Part Number 1: 81-GRM39X104K50D
CK50 CK57 = ECK+100N50V0603XXK: MLCC, Size 0603, 100nF/50V, X7R; Value: 1n; Signal Integrity: Cap; Tolerance & Rating: 10%/50V; Package: SMC0603; Simulation: Cap; Author: JP/10.06.2014; SMD: 1
L1 L2 = IFSC1515AHER6R8M01: Low Profile, High Current Inductor; Tolerance & Rating: 20%, 1.5A/0.1Ohm DRC; Value: 6.8u/1.5A; Author: JM 29.5.2014; SMD: 1; Supplier 1: Mouser; Supplier Part Number 1: 70-IFSC1515AHER6R8M0; ClassName: DirectConnect
R60 R64 = ER+4K70.1W0603XXF: Thick Film resistor, Size 0603, 4k7, 0,1W, 1%; Tolerance & Rating: 1%/0.1W; Signal Integrity: Res; Value: tbd; Package: 0603; Simulation: Res; Author: JP/10.06.2014; SMD: 1
R63 R67 = 4K3-100mW-0603-ThickFilm: as R7 on sheet DSPcontrol; Value: 4k3; Simulation: Res; Author: JP/10.06.2014; SMD: 1; Supplier 1: Mouser; Supplier Part Number 1: 603-RC0603FR-074K3L; Type: Resistor
R66 = 10k-100mW-0603-ThickFilm: as R10 on sheet DSPclk; Value: 10k; Simulation: Res; Author: JP/10.06.2014; SMD: 1; Supplier 1: Mouser; Supplier Part Number 1: 603-RC0603FR-0710KL; Type: Resistor
R68 R84 = 2K7-100mW-0603-ThickFilm: as R38 on sheet PowerSupply; Value: 2k7; Simulation: Res; Author: JP/26.03.2017; SMD: 1; Supplier 1: Mouser; Supplier Part Number 1: 603-RC0603FR-072K7L; Type: Resistor
R71 = 220k-100mW-0603-ThickFilm: as R17 on sheet DSPcontrol; Value: 220k; Simulation: Res; Author: JP/10.06.2014; SMD: 1; Supplier 1: Mouser; Supplier Part Number 1: 603-RC0603FR-07220KL; Type: Resistor
R72 = 47k-100mW-0603-ThickFilm: Chip Resistor; Tolerance & Rating: 1%/0.1W; Signal Integrity: Res; Packare: SMR0603; Value: 47k; Simulation: Res; Author: JP/10.06.2014; SMD: 1; Supplier 1: Mouser; Supplier Part Number 1: 603-RC0603FR-0747KL; Type: Resistor
R86 = 56k-100mW-0603-ThickFilm: Chip Resistor; Tolerance & Rating: 1%/0.1W; Signal Integrity: Res; Packare: SMR0603; Value: 56k; Simulation: Res; Author: JP/10.06.2014; SMD: 1; Supplier 1: Mouser; Supplier Part Number 1: 603-RC0603FR-0756KL; Type: Resistor
TP41 TP42 TP52 TP55 = TEST_POINT_VIA: Testpoint - VIA; Value: 0.65/1.55; SMD: -; ClassName: TP
U11 = TPS54292: 1.5-A/2.5-A Dual, Fully-Synchronous Buck Converter; Value: TPS54292; SMD: 1; Supplier 1: Mouser; Supplier Part Number 1: 595-TPS54292PWPR; ClassName: DirectConnect

## Sheet InputFilter.SchDoc: Input Filter
size A4; Date: 08.04.2017; CheckedBy: CheckedBy; Author: Jan Petrik; CompanyName: FreeDSP; DrawnBy: Jan Petrik; Organization: FreeDSP; DocumentNumber: 3; Revision: B2; SheetNumber: 3; SheetTotal: 16; Version1: N/A; Version2: N/A; Version3: N/A; Change1description: N/A; Change2description: N/A; Change3description: N/A; Change1DrawnBy: N/A; Change2DrawnBy: N/A; Change3DrawnBy: N/A; Change1CheckedBy: N/A; Change2CheckedBy: N/A; Change3CheckedBy: N/A; PreviusVersion_Chng1: N/A; PreviusVersion_Chng2: N/A; PreviusVersion_Chng3: N/A; Variant1description: Standard assembly; Variant2description: N/A; Variant3description: N/A; Variant4description: N/A; email: jan_petrik@centrum.cz; license: CC BY-NC 4.0; DocumentName: Docname
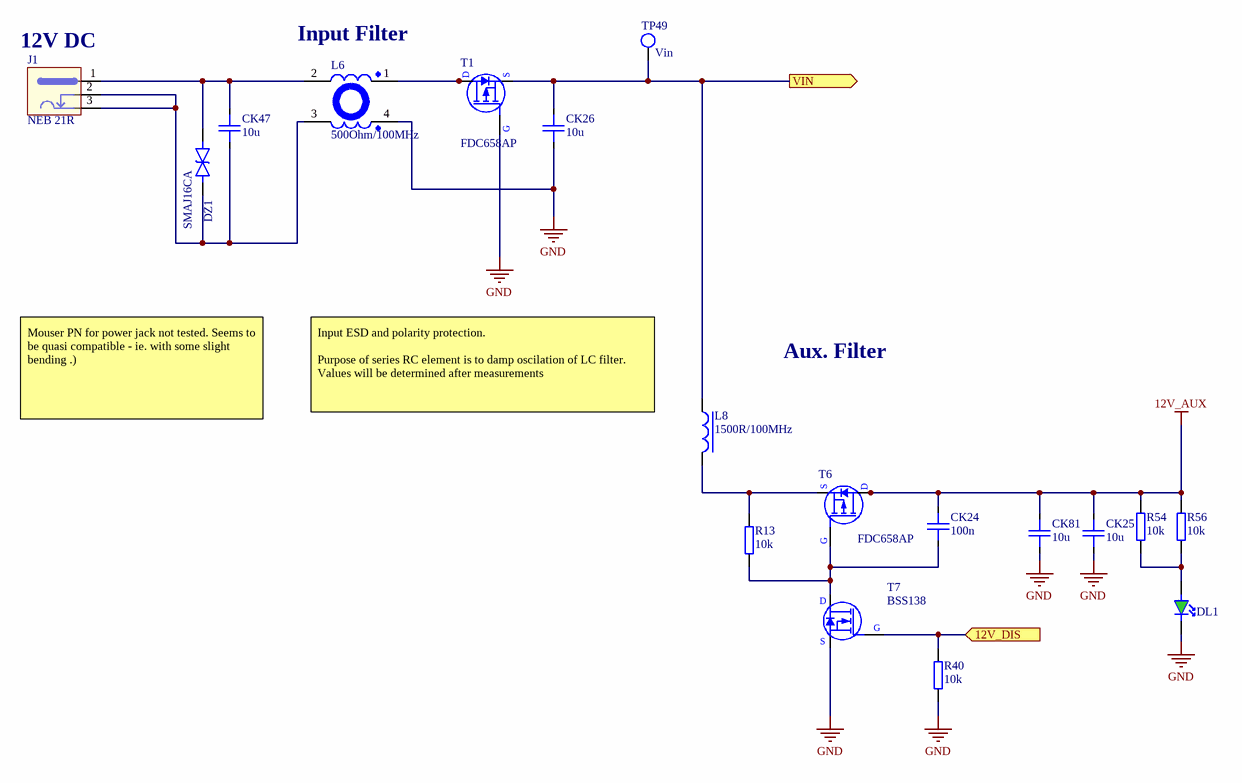
[diagram p8: InputFilter.SchDoc]

### Parts
CK24  100n  [CAPC1608X09N(SMC0603)]
CK25  10u  [CAPC3216X12N(SMC1206)]
CK26  10u  [CAPC3216X12N(SMC1206)]
CK47  10u  [CAPC3216X12N(SMC1206)]
CK81  10u  [CAPC3216X12N(SMC1206)]
DL1  GREEN  [0603diode]  (value not drawn)
DZ1  SMAJ16CA  [DIOM5127X23N(SMA)]
J1  NEB 21R  [NEB 21 R]
L6  500Ohm/100MHz  [DLW5BT]
L8  1500R/100MHz  [INDC2012X08N(SML0805)]
R13  10k  [RESC1608X06N(SMR0603)]
R40  10k  [RESC1608X06N(SMR0603)]
R54  10k  [RESC1608X06N(SMR0603)]
R56  10k  [RESC1608X06N(SMR0603)]
T1  FDC658AP  [TSOP95P280X110-6N(SuperSOT6)]
T6  FDC658AP  [TSOP95P280X110-6N(SuperSOT6)]
T7  BSS138  [SOT95P230X110-3N(SOT23)]
TP49  Vin  [TP_0.8/0.4_ROUND]  (no BOM)

### Ports
12V_DIS (in), VIN (out)

### Nets
12V_AUX: CK24.1 CK25.1 CK81.1 R54.2 R56.2 T6.1(D) T6.2(D) T6.5(D) T6.6(D)
GND: CK25.2 CK26.2 CK81.2 DL1.1(C) L6.4 R40.1 T1.3(G) T7.2(S)
12V_DIS: R40.2 T7.1(G) ; port 12V_DIS
V_IN: CK26.1 L8.1 T1.4(S) TP49.1 ; port VIN
NetCK24_2: CK24.2 R13.1 T6.3(G) T7.3(D)
NetCK47_1: CK47.1 DZ1.1(AC) J1.1(Signal) L6.2
NetCK47_2: CK47.2 DZ1.2(AC) J1.2(GND) J1.3(GND) L6.3
NetDL1_2: DL1.2(A) R54.1 R56.1
NetL6_1: L6.1 T1.1(D) T1.2(D) T1.5(D) T1.6(D)
NetL8_2: L8.2 R13.2 T6.4(S)

### Notes on the sheet
- (near J1) 12V DC
- (near L6) Input Filter
- Aux. Filter
- Mouser PN for power jack not tested. Seems to be quasi compatible - ie. with some slight bending .)
- (near L8) Input ESD and polarity protection.
  Purpose of series RC element is to damp oscilation of LC filter. Values will be determined after measurements
- Designed by:
- Sheet Title:
- Board Revision:
- License:
- Email:
- www.freedsp.cc
- www.pidsp.com
- Date:
- Sheet:
- /

### Library data of the parts
CK24 = 100n-50V-0603-X7R: MLCC; Signal Integrity: Cap; Tolerance: 10%; Voltage: 50V; Value: 100n; Package: SMC2523; Simulation: Cap; Author: JP/27.03.2014; Supplier 1: Mouser; Supplier Part Number 1: 81-GRM39X104K50D
CK25 CK47 CK81 = 10u-50V-1206-X5R: as CK29 on sheet LP5907MFX-3.3NPB; Value: 10u; Package: SMC1206; Simulation: Cap; Author: JP/10.06.2014; Supplier 1: Mouser; Supplier Part Number 1: 81-GRM31CR61H106MA2L
CK26 = 10u-50V-1206-X5R: as CK27 on sheet TPS54292; Value: 10u; Package: SMC1206; Simulation: Cap; Author: JP/10.06.2014; Supplier 1: Mouser; Supplier Part Number 1: 81-GRM31CR61H106MA2L
DL1 = LED_GREEN_0603: Green LED, 0603; Author: JP/31.3.2014; SMD: 1; Supplier 1: Mouser; Supplier Part Number 1: 710-150060GS75000
DZ1 = SMAJ16CA: Surface Mount TRANSZORB TVS, 16V StandOff, 400W, SMA; Tolerance & Rating: 16V 400W; Value: SMAJ16CA; Package: SMA (DO-214AC); SMD: 1; Supplier 1: Mouser; Supplier Part Number 1: 652-SMAJ16CA
J1 = Lumberg NEB 21 R: Power Jack Socket 1.95/6mm; SMD: 0; Supplier 1: Mouser; Supplier Part Number 1: 490-PJ-050AH; Supplier 2: Farnell; Supplier Part Number 2: 1217037
L6 = EL+EMICHOKE4A: CHOKE, COMMON, 4A, 500OHM, 100MHZ; SMD: 1; Author: JP 15.10.2014; Value: 500Ohm/100MHz; Supplier 1: Mouser; Supplier Part Number 1: 81-DLW5BTM501SQ2L
L8 = MMZ2012Y152B: as L5 on sheet LP5907MFX-3.3NPB; Value: 1500R/100MHz; Author: JP/05.06.2014; SMD: 1; Supplier 1: Mouser; Supplier Part Number 1: 810-MMZ2012Y152B; ClassName: DirectConnect
R13 R40 R54 R56 = 10k-100mW-0603-ThickFilm: as R10 on sheet DSPclk; Value: 10k; Simulation: Res; Author: JP/10.06.2014; SMD: 1; Supplier 1: Mouser; Supplier Part Number 1: 603-RC0603FR-0710KL; Type: Resistor
T1 T6 = FDC658AP: 30V P  -  Channel PowerTrench  MOSFET; Value: FDC658AP; SMD: 1; Supplier 1: Mouser; Supplier Part Number 1: 512-FDC658AP
T7 = ET+BSS138XX0: as T3 on sheet DSPclk; Author: JM 2.7.2014; SMD: 1; Value: BSS138; PN: BSS138; Supplier 1: Mouser; Supplier Part Number 1: 512-BSS138
TP49 = TEST_POINT_VIA: Testpoint - VIA; Value: 0.65/1.55; SMD: -; ClassName: TP

## Sheet Buck+PM.SchDoc: 5V Regulator
size A4; Date: 08.04.2017; CheckedBy: CheckedBy; Author: Jan Petrik; CompanyName: FreeDSP; DrawnBy: Jan Petrik; Organization: FreeDSP; DocumentNumber: 4; Revision: B2; SheetNumber: 4; SheetTotal: 16; Version1: N/A; Version2: N/A; Version3: N/A; Change1description: N/A; Change2description: N/A; Change3description: N/A; Change1DrawnBy: N/A; Change2DrawnBy: N/A; Change3DrawnBy: N/A; Change1CheckedBy: N/A; Change2CheckedBy: N/A; Change3CheckedBy: N/A; PreviusVersion_Chng1: N/A; PreviusVersion_Chng2: N/A; PreviusVersion_Chng3: N/A; Variant1description: Standard assembly; Variant2description: N/A; Variant3description: N/A; Variant4description: N/A; email: jan_petrik@centrum.cz; license: CC BY-NC 4.0; DocumentName: Docname
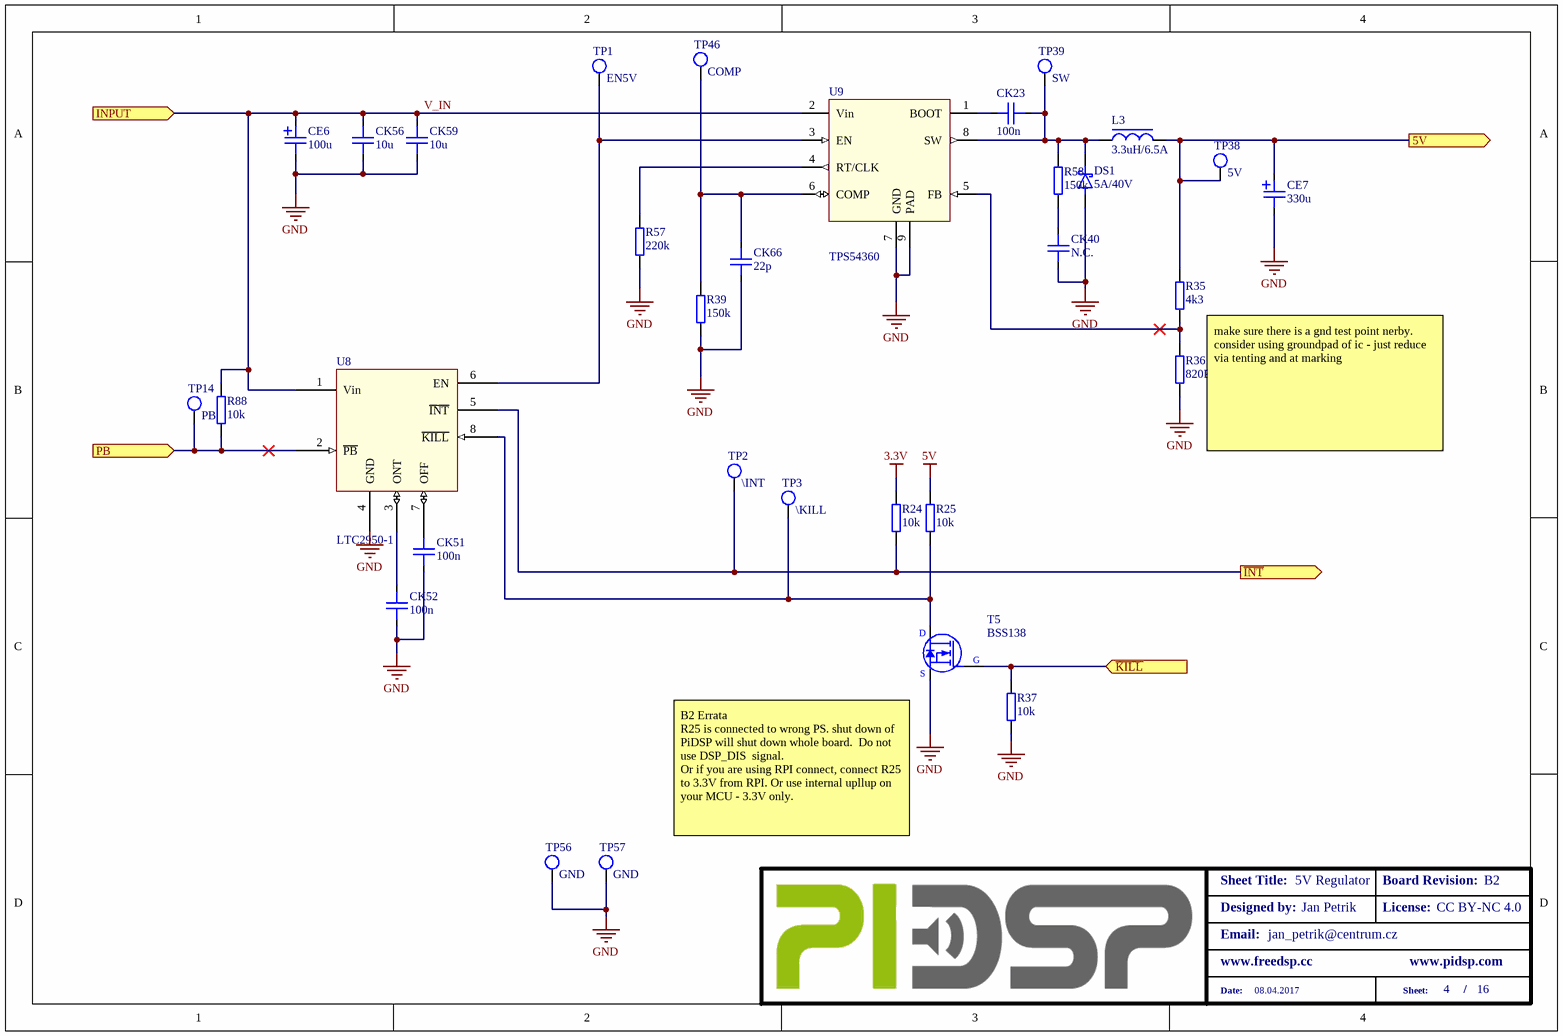
[diagram p9: Buck+PM.SchDoc]

### Parts
CE6  100u  [CAPAE6.8X6.8(D_SIZE)]
CE7  330u  [CAPAE6.8X6.8(D_SIZE)]
CK23  100n  [CAPC1608X09N(SMC0603)]
CK40  N.C.  [CAPC1608X09N(SMC0603)]
CK51  100n  [CAPC1608X09N(SMC0603)]
CK52  100n  [CAPC1608X09N(SMC0603)]
CK56  10u  [CAPC3216X12N(SMC1206)]
CK59  10u  [CAPC3216X12N(SMC1206)]
CK66  22p  [CAPC1608X09N(SMC0603)]
DS1  5A/40V  [DIOM6959X26M(SMC)]
L3  3.3uH/6.5A  [INDM_7.2x6.5]
R24  10k  [RESC1608X06N(SMR0603)]
R25  10k  [RESC1608X06N(SMR0603)]
R35  4k3  [RESC1608X06N(SMR0603)]
R36  820R  [RESC1608X06N(SMR0603)]
R37  10k  [RESC1608X06N(SMR0603)]
R39  150k  [RESC1608X06N(SMR0603)]
R57  220k  [RESC1608X06N(SMR0603)]
R58  150k  [RESC1608X06N(SMR0603)]
R88  10k  [RESC1608X06N(SMR0603)]
T5  BSS138  [SOT95P230X110-3N(SOT23)]
TP1  EN5V  [TP_0.8/0.4_ROUND]  (no BOM)
TP2  \INT  [TP_0.8/0.4_ROUND]  (no BOM)
TP3  \KILL  [TP_0.8/0.4_ROUND]  (no BOM)
TP14  PB  [TP_0.8/0.4_ROUND]  (no BOM)
TP38  5V  [TP_0.8/0.4_ROUND]  (no BOM)
TP39  SW  [TP_0.8/0.4_ROUND]  (no BOM)
TP46  COMP  [TP_0.8/0.4_ROUND]  (no BOM)
TP56  GND  [TP_0.8/0.4_ROUND]  (no BOM)
TP57  GND  [TP_0.8/0.4_ROUND]  (no BOM)
U8  LTC2950-1  [LT-TS8-8-TSOT-23_V]
U9  TPS54360  [SOIC127P600X175-8N(SOIC_8)-POWERPAD_HP]

### Ports
5V (out), INPUT (in), PB (in), ~{INT} (out), ~{KILL} (in)

### Nets
3.3V: R24.2
5V: CE7.1 L3.2 R25.2 R35.2 TP38.1 ; port 5V
GND: CE6.2 CE7.2 CK40.2 CK51.2 CK52.2 CK56.2 CK59.2 CK66.1 DS1.2(A) R36.1 R37.1 R39.1 R57.1 T5.2(S) TP56.1 TP57.1 U8.4(GND) U9.7(GND) U9.9(PAD)
~{INT}: R24.1 TP2.1 U8.5(~{INT}) ; port ~{INT}
~{KILL}: R37.2 T5.1(G) ; port ~{KILL}
PB: R88.1 TP14.1 U8.2(~{PB}) ; port PB
V_IN: CE6.1 CK56.1 CK59.1 R88.2 U8.1(Vin) U9.2(Vin) ; port INPUT
NetCK23_1: CK23.1 DS1.1(C) L3.1 R58.2 TP39.1 U9.8(SW)
NetCK23_2: CK23.2 U9.1(BOOT)
NetCK40_1: CK40.1 R58.1
NetCK51_1: CK51.1 U8.7(OFF)
NetCK52_1: CK52.1 U8.3(ONT)
NetCK66_2: CK66.2 R39.2 TP46.1 U9.6(COMP)
NetR25_1: R25.1 T5.3(D) TP3.1 U8.8(~{KILL})
NetR35_1: R35.1 R36.2 U9.5(FB)
NetR57_2: R57.2 U9.4(RT/CLK)
NetTP1_1: TP1.1 U8.6(EN) U9.3(EN)

### Notes on the sheet
- make sure there is a gnd test point nerby. consider using groundpad of ic - just reduce via tenting and at marking
- (near T5) B2 Errata
  R25 is connected to wrong PS. shut down of  PiDSP will shut down whole board.  Do not use DSP_DIS  signal.
  Or if you are using RPI connect, connect R25 to 3.3V from RPI. Or use internal upllup on your MCU - 3.3V only.
- Designed by:
- Sheet Title:
- Board Revision:
- License:
- Email:
- www.freedsp.cc
- www.pidsp.com
- Date:
- Sheet:
- /

### Library data of the parts
CE6 = 100u-16V-B6-OSCON: Polymer Aluminium Solid Capacitor 100uF, 16V; Mfg. Part Number: 875105344010; Signal Integrity: Cap; Tolerance: 20%/16V; Mfgr.: Wurth; Value: 100u; Package: D8H6.3; Simulation: Cap; Author: JP/27.03.2014; Voltage: 16V; Supplier 1: Mouser; Supplier Part Number 1: 710-875105344010
CE7 = 330u-6.3V-B6-OSCON: Polymer Aluminium Solid Capacitor 330uF, 6.3V; Signal Integrity: Cap; Tolerance: 20%/35V; Value: 330u; Package: D8H6.3; Simulation: Cap; Author: JP/27.03.2014; Voltage: 6.3V; Supplier 1: Mouser; Supplier Part Number 1: 710-875105144010; ClassName: DirectConnect
CK23 CK40 CK51 CK52 = 100n-50V-0603-X7R: as CK53 on sheet DSPcontrol; Package: SMC2523; Simulation: Cap; Author: JP/27.03.2014; Supplier 1: Mouser; Supplier Part Number 1: 81-GRM39X104K50D
  CK23: Value: 100n; ClassName: DirectConnect
  CK40: Value: N.C.
  CK51 CK52: Value: 100n
CK56 CK59 = 10u-50V-1206-X5R: as CK27 on sheet TPS54292; Value: 10u; Package: SMC1206; Simulation: Cap; Author: JP/10.06.2014; Supplier 1: Mouser; Supplier Part Number 1: 81-GRM31CR61H106MA2L; ClassName: DirectConnect
CK66 = 22p-50V-0603-NP0: as CK31 on sheet TPS54292; Value: 22p; Package: SMC0603; Simulation: Cap; Author: JP/27.03.2014; Supplier 1: Mouser; Supplier Part Number 1: 81-GCM1885C1H220J16D
DS1 = SSC54-E3: High Current Density SMT Schottky Rectifier, 5A/40V, SMC; Value: 5A/40V; Package: SMC; Supplier 1: Mouser; Supplier Part Number 1: 625-SSC54-E3; ClassName: DirectConnect
L3 = SRP6540_3.3u: SRP6540 Series - Shielded Power Inductors; SMD: 1; Value: 3.3uH/6.5A; Supplier 1: Mouser; Supplier Part Number 1: 652-SRP6540-3R3M; ClassName: DirectConnect
R24 R25 R37 R88 = 10k-100mW-0603-ThickFilm: as R10 on sheet DSPclk; Value: 10k; Simulation: Res; Author: JP/10.06.2014; SMD: 1; Supplier 1: Mouser; Supplier Part Number 1: 603-RC0603FR-0710KL; Type: Resistor
R35 = 4K3-100mW-0603-ThickFilm: as R7 on sheet DSPcontrol; Value: 4k3; Simulation: Res; Author: JP/10.06.2014; SMD: 1; Supplier 1: Mouser; Supplier Part Number 1: 603-RC0603FR-074K3L; Type: Resistor
R36 = 820R-100mW-0603-ThickFilm: Chip Resistor; Tolerance & Rating: 1%/0.1W; Signal Integrity: Res; Packare: SMR0603; Value: 820R; Simulation: Res; Author: JP/10.06.2014; SMD: 1; Supplier 1: Mouser; Supplier Part Number 1: 603-RC0603FR-07820RL; Type: Resistor
R39 R58 = 150k-100mW-0603-ThickFilm: Chip Resistor; Tolerance & Rating: 1%/0.1W; Signal Integrity: Res; Packare: SMR0603; Value: 150k; Simulation: Res; Author: JP/10.06.2014; SMD: 1; Supplier 1: Mouser; Supplier Part Number 1: 603-RC0603FR-07150KL; Type: Resistor
R57 = 220k-100mW-0603-ThickFilm: as R17 on sheet DSPcontrol; Value: 220k; Simulation: Res; Author: JP/10.06.2014; SMD: 1; Supplier 1: Mouser; Supplier Part Number 1: 603-RC0603FR-07220KL; Type: Resistor
T5 = ET+BSS138XX0: as T3 on sheet DSPclk; Author: JM 2.7.2014; SMD: 1; Value: BSS138; PN: BSS138; Supplier 1: Mouser; Supplier Part Number 1: 512-BSS138
TP1-TP3 TP14 TP38 TP39 TP46 TP56 TP57 = TEST_POINT_VIA: Testpoint - VIA; Value: 0.65/1.55; SMD: -; ClassName: TP
U8 = LTC2950-1: Pushbutton On/Off    Controller; Value: LTC2950-1; SMD: 1; Supplier 1: Farnell; Supplier Part Number 1: 2115908
U9 = TPS54360: 3.5 A, Step Down DC-DC Converter; Value: TPS54360; SMD: 1; Supplier 1: Mouser; Supplier Part Number 1: 595-TPS54360DDAR; ClassName: DirectConnect